# EAGLE schematic whitherbone (EAGLE 6.4)
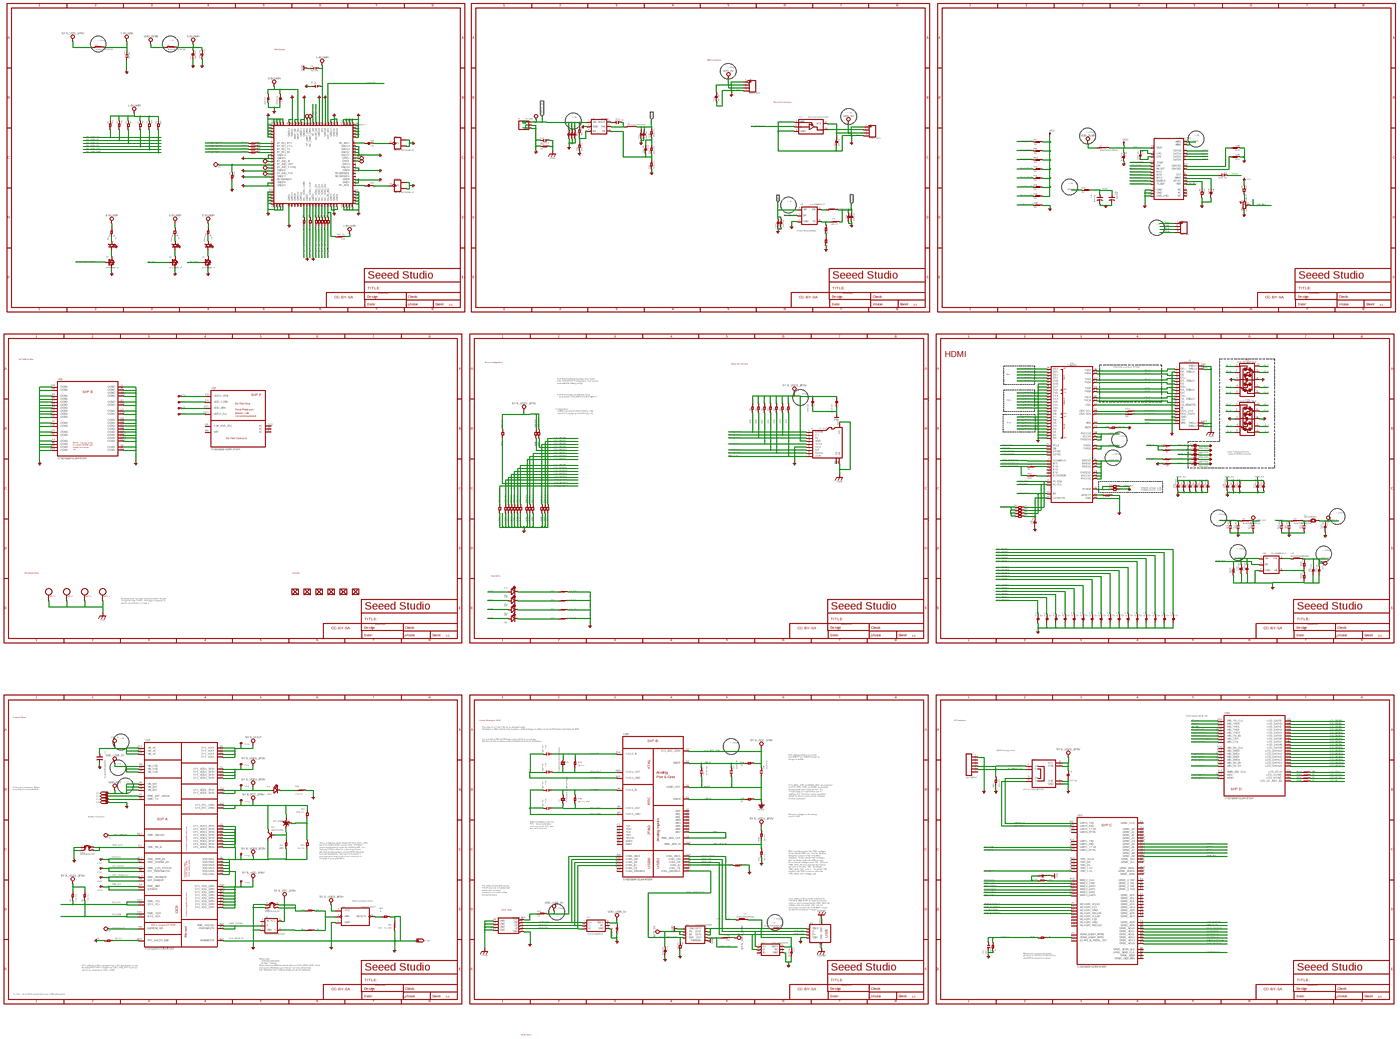
[diagram p0: schematic, sheet 1, overview]
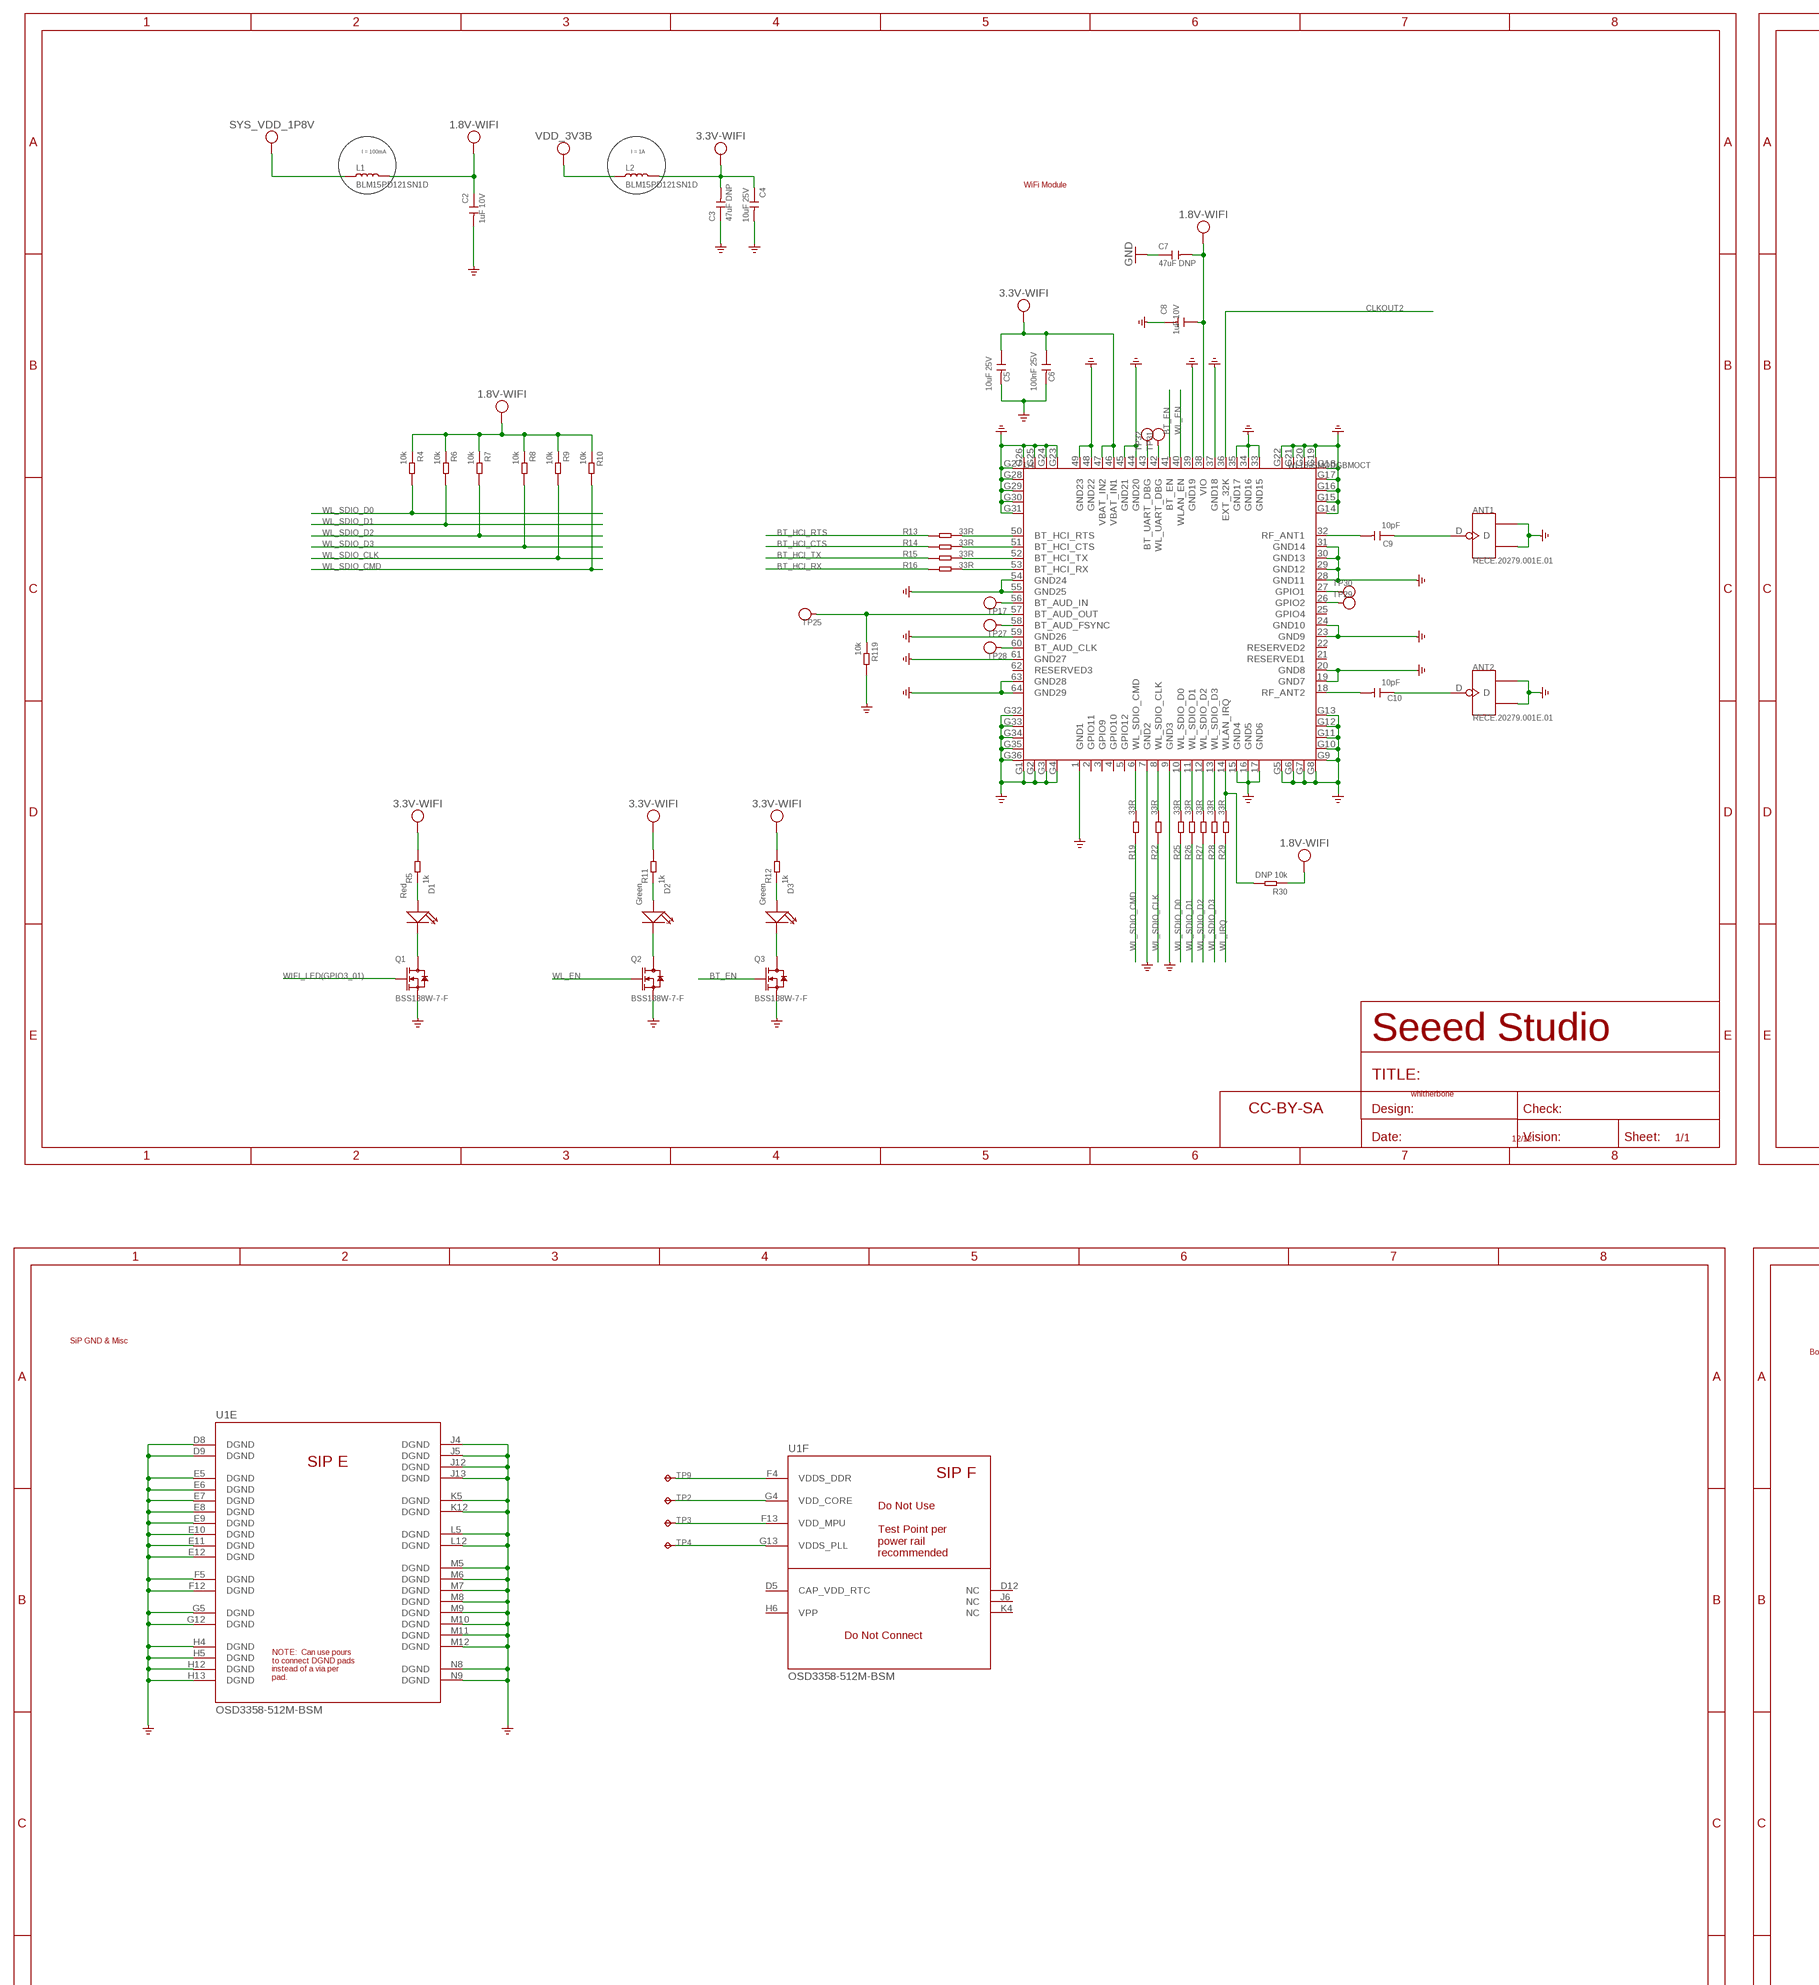
[diagram p1: schematic, sheet 1, part 1 of 8]
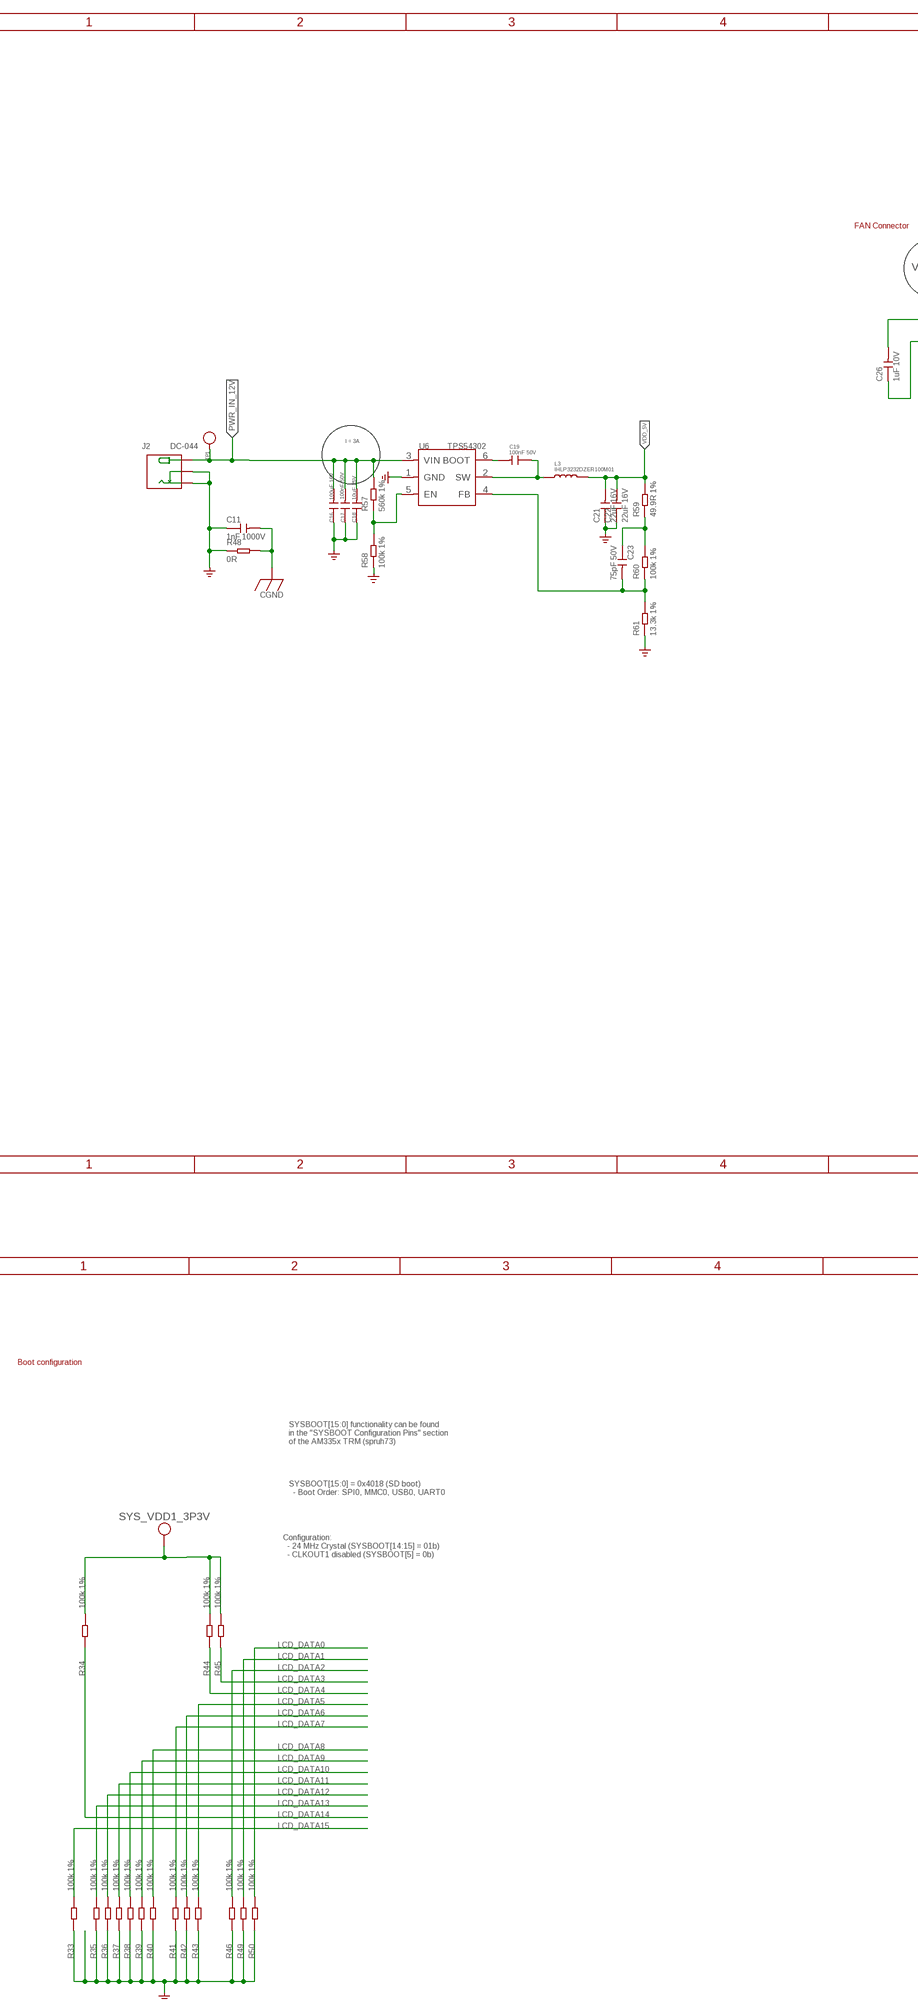
[diagram p2: schematic, sheet 1, part 2 of 8]
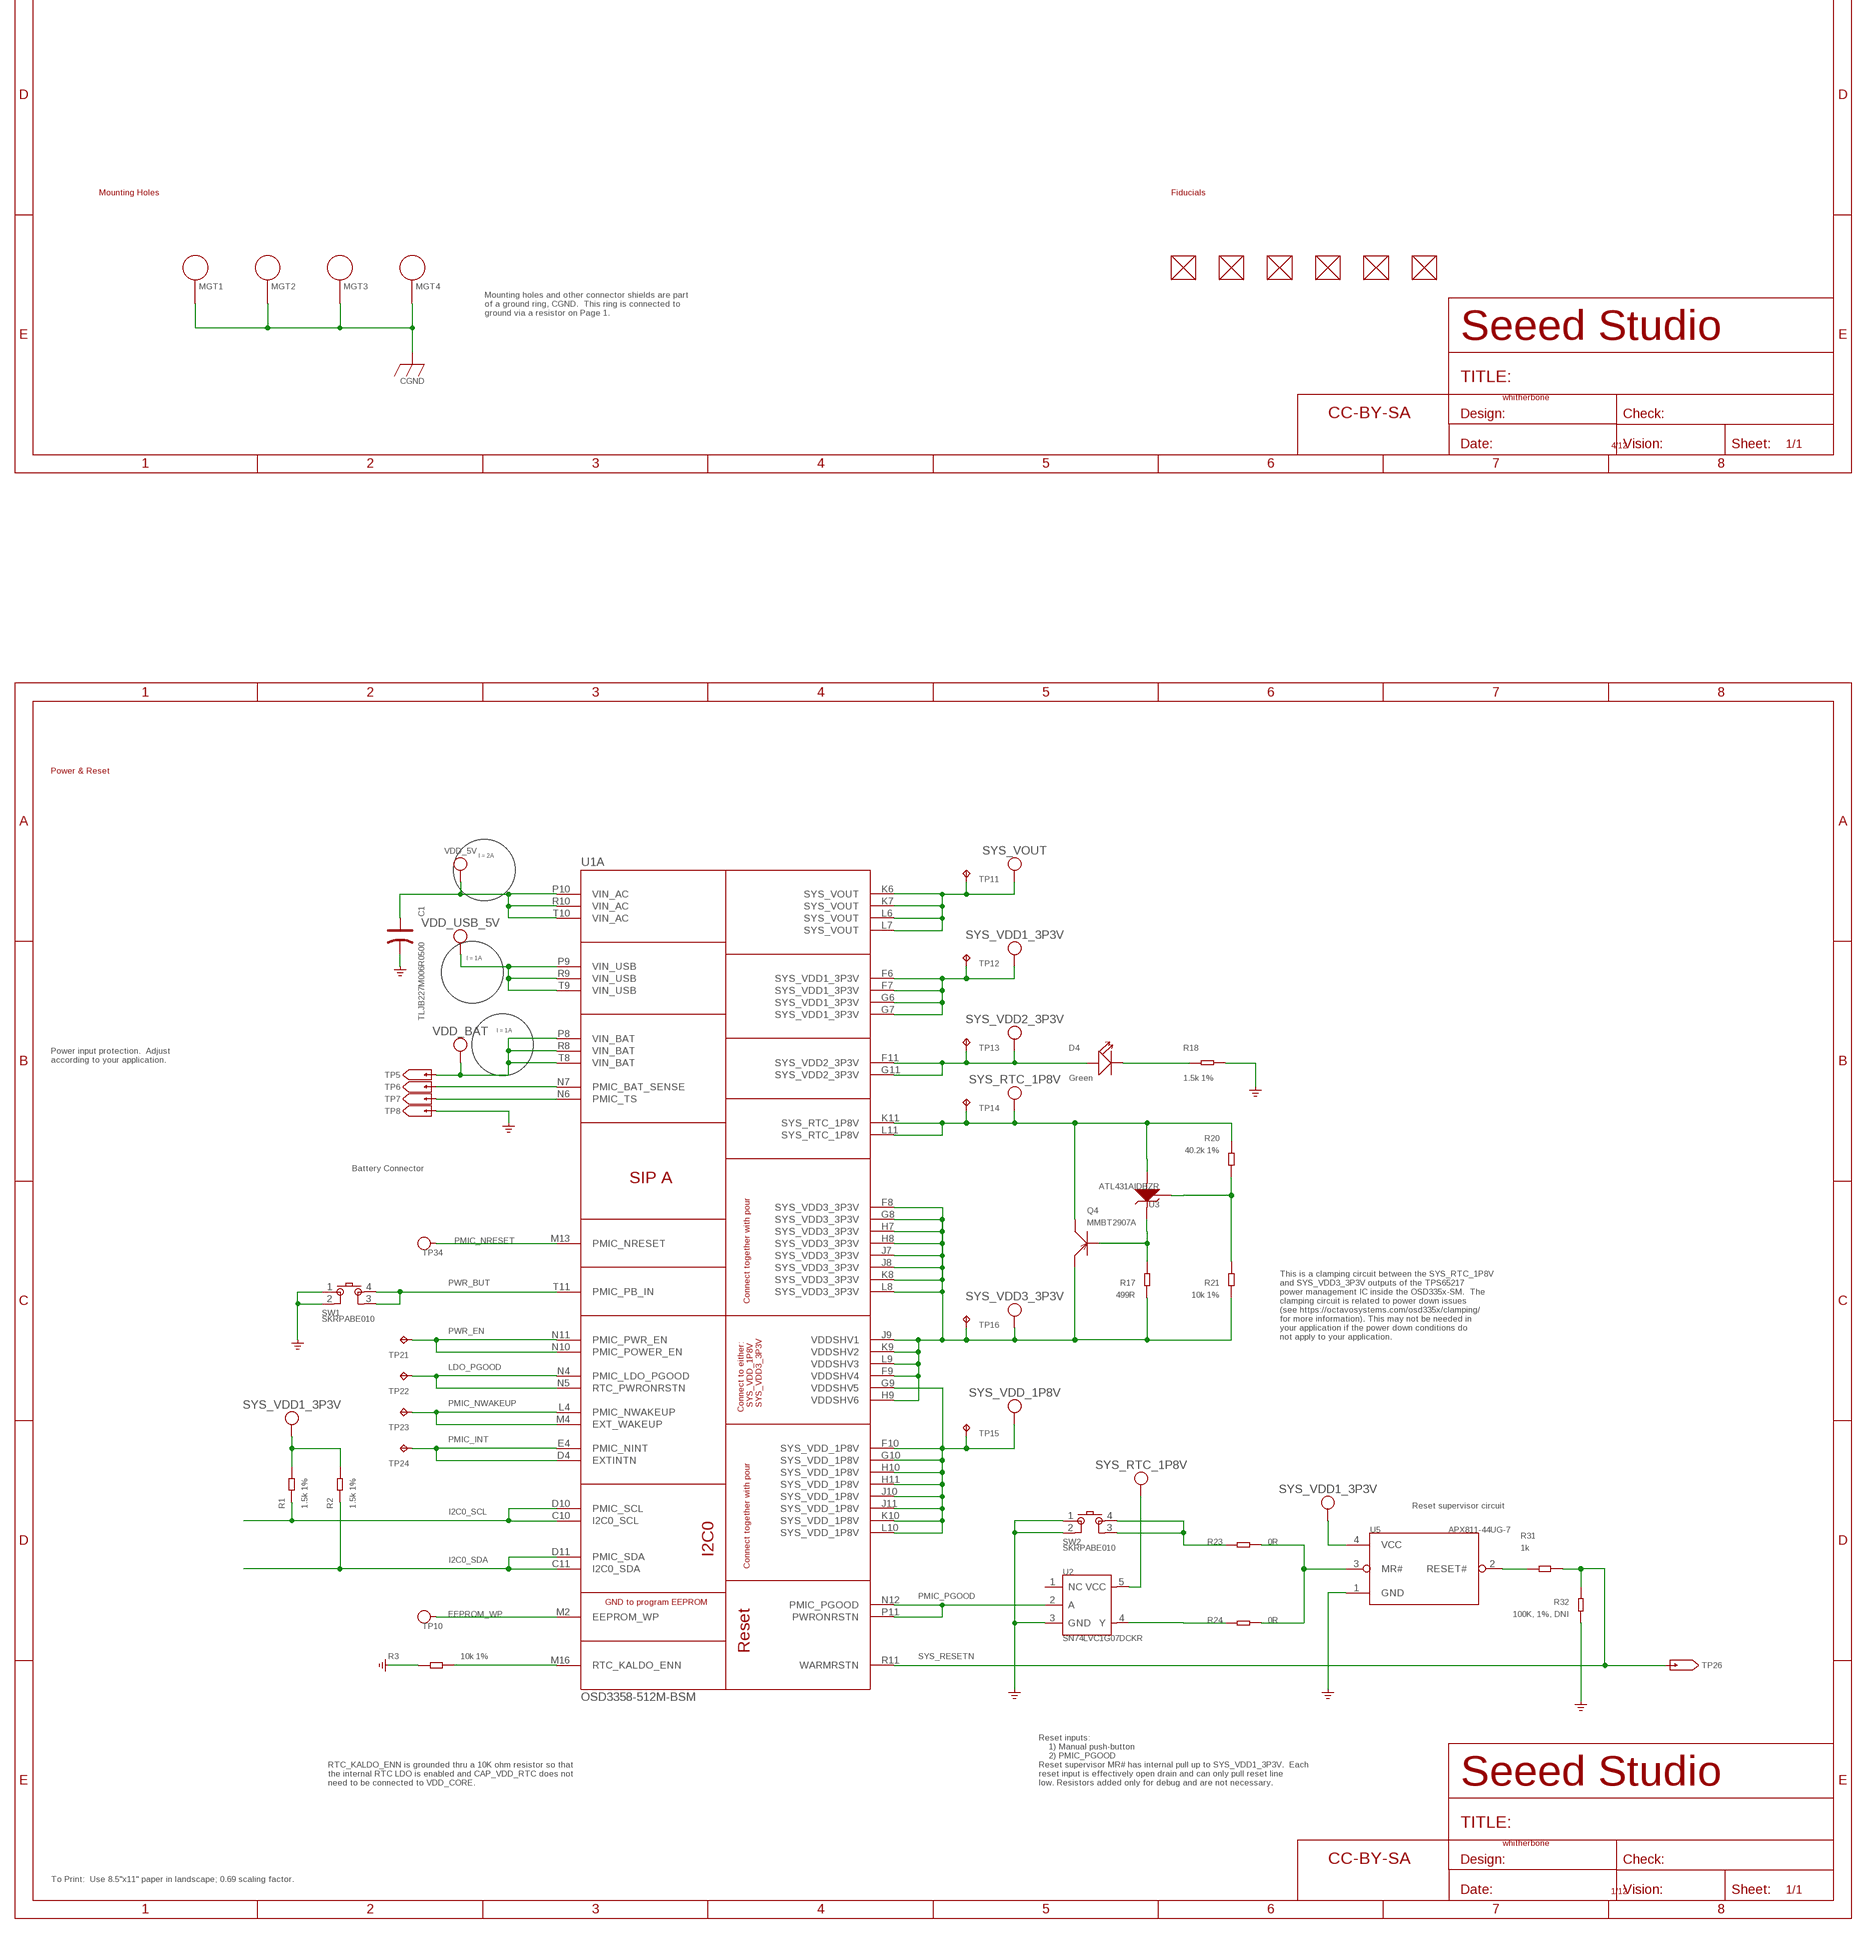
[diagram p3: schematic, sheet 1, part 3 of 8]
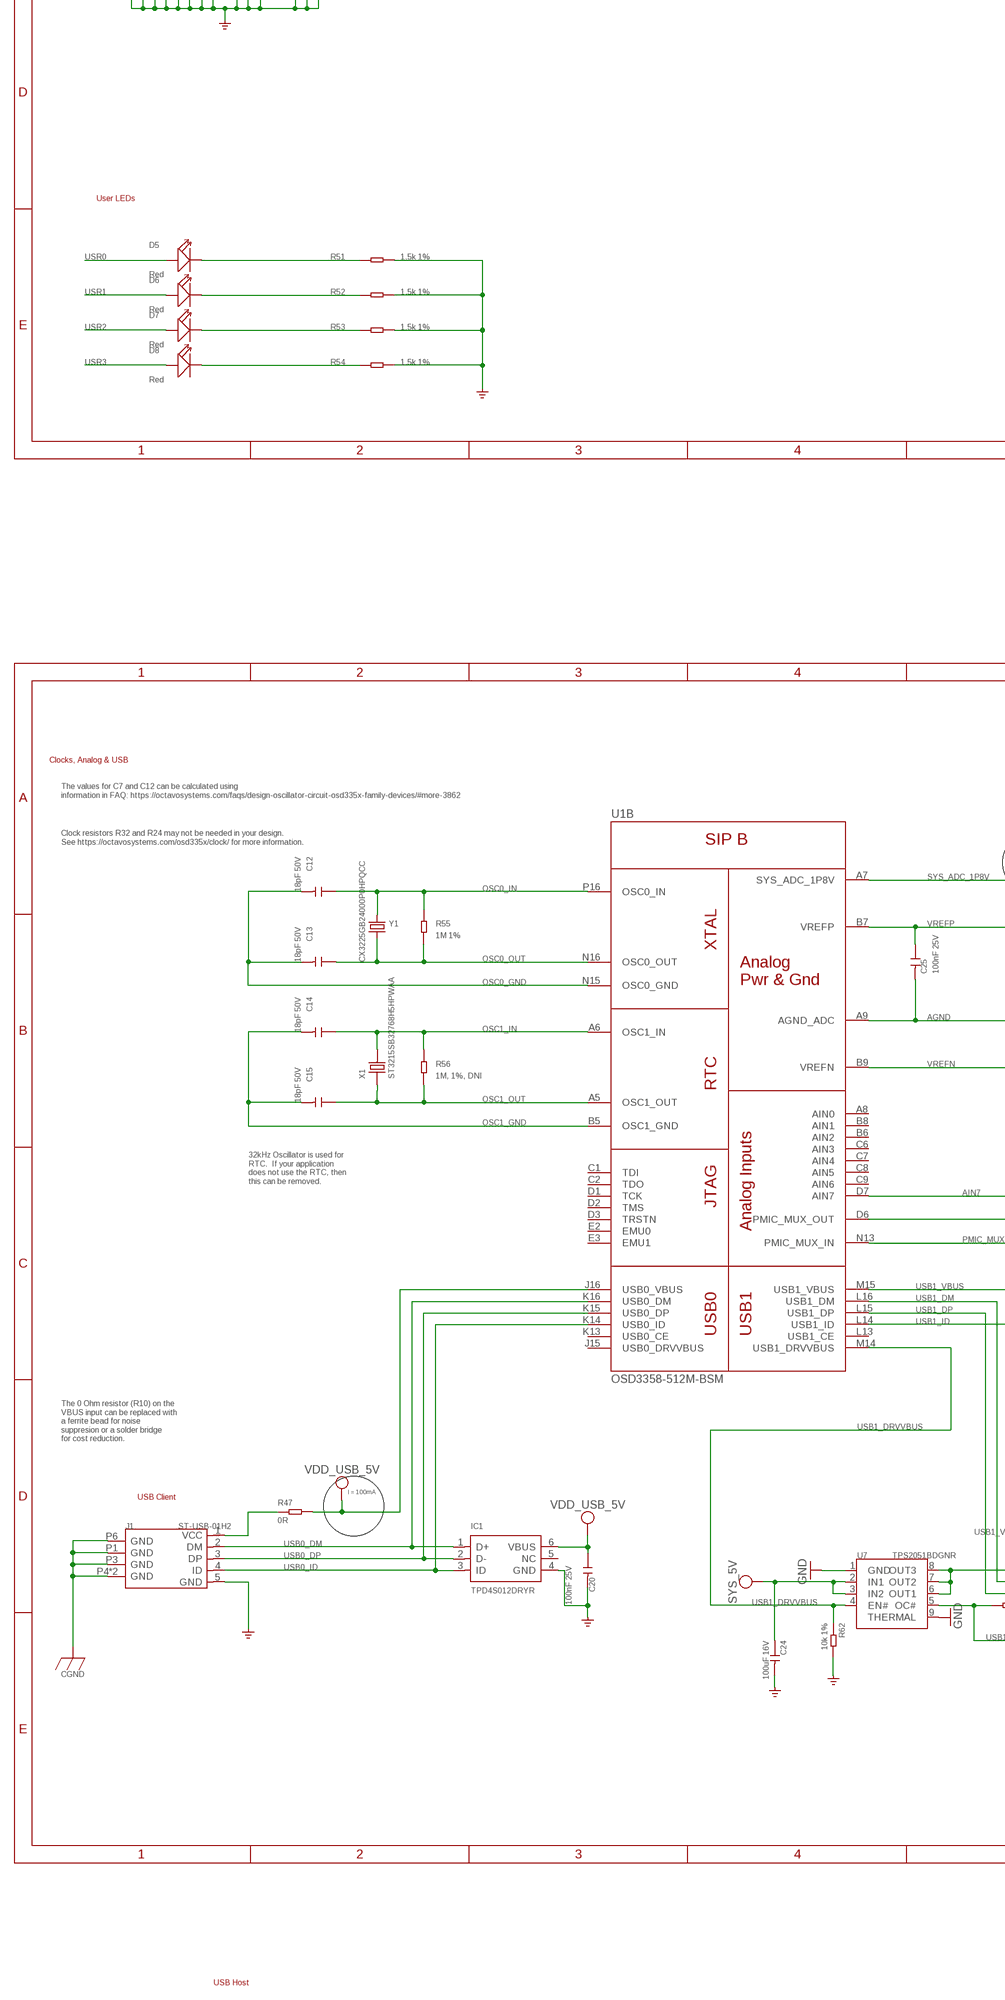
[diagram p4: schematic, sheet 1, part 4 of 8]
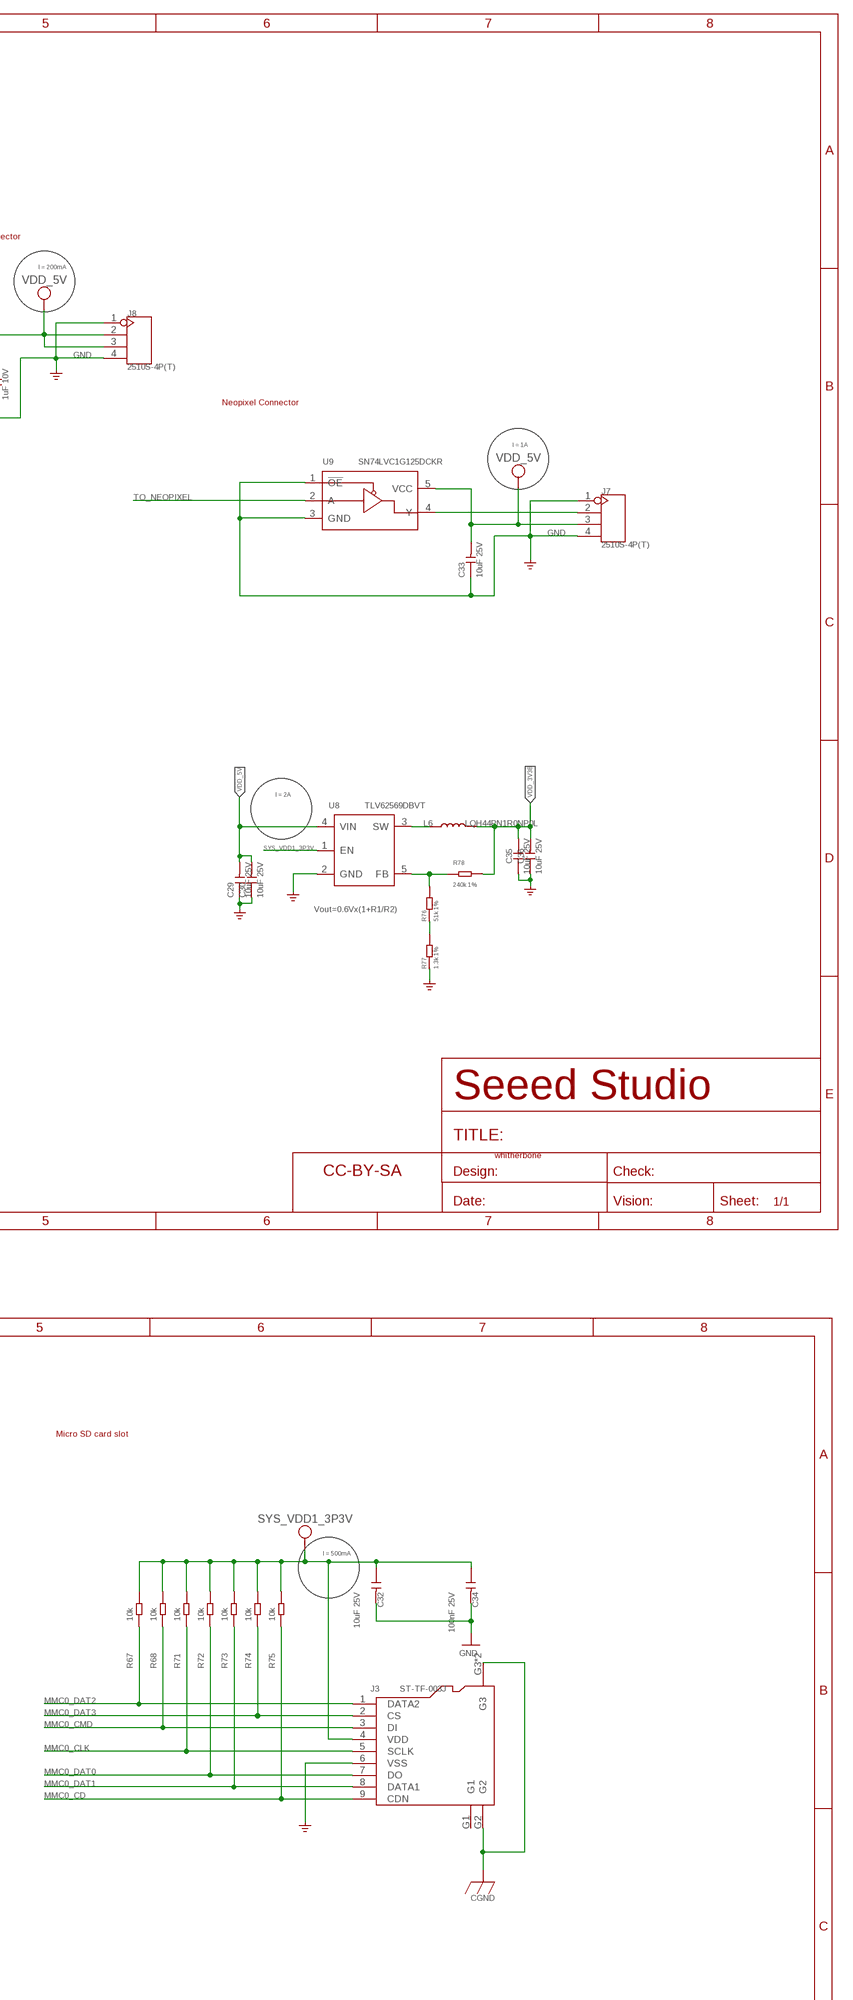
[diagram p5: schematic, sheet 1, part 5 of 8]
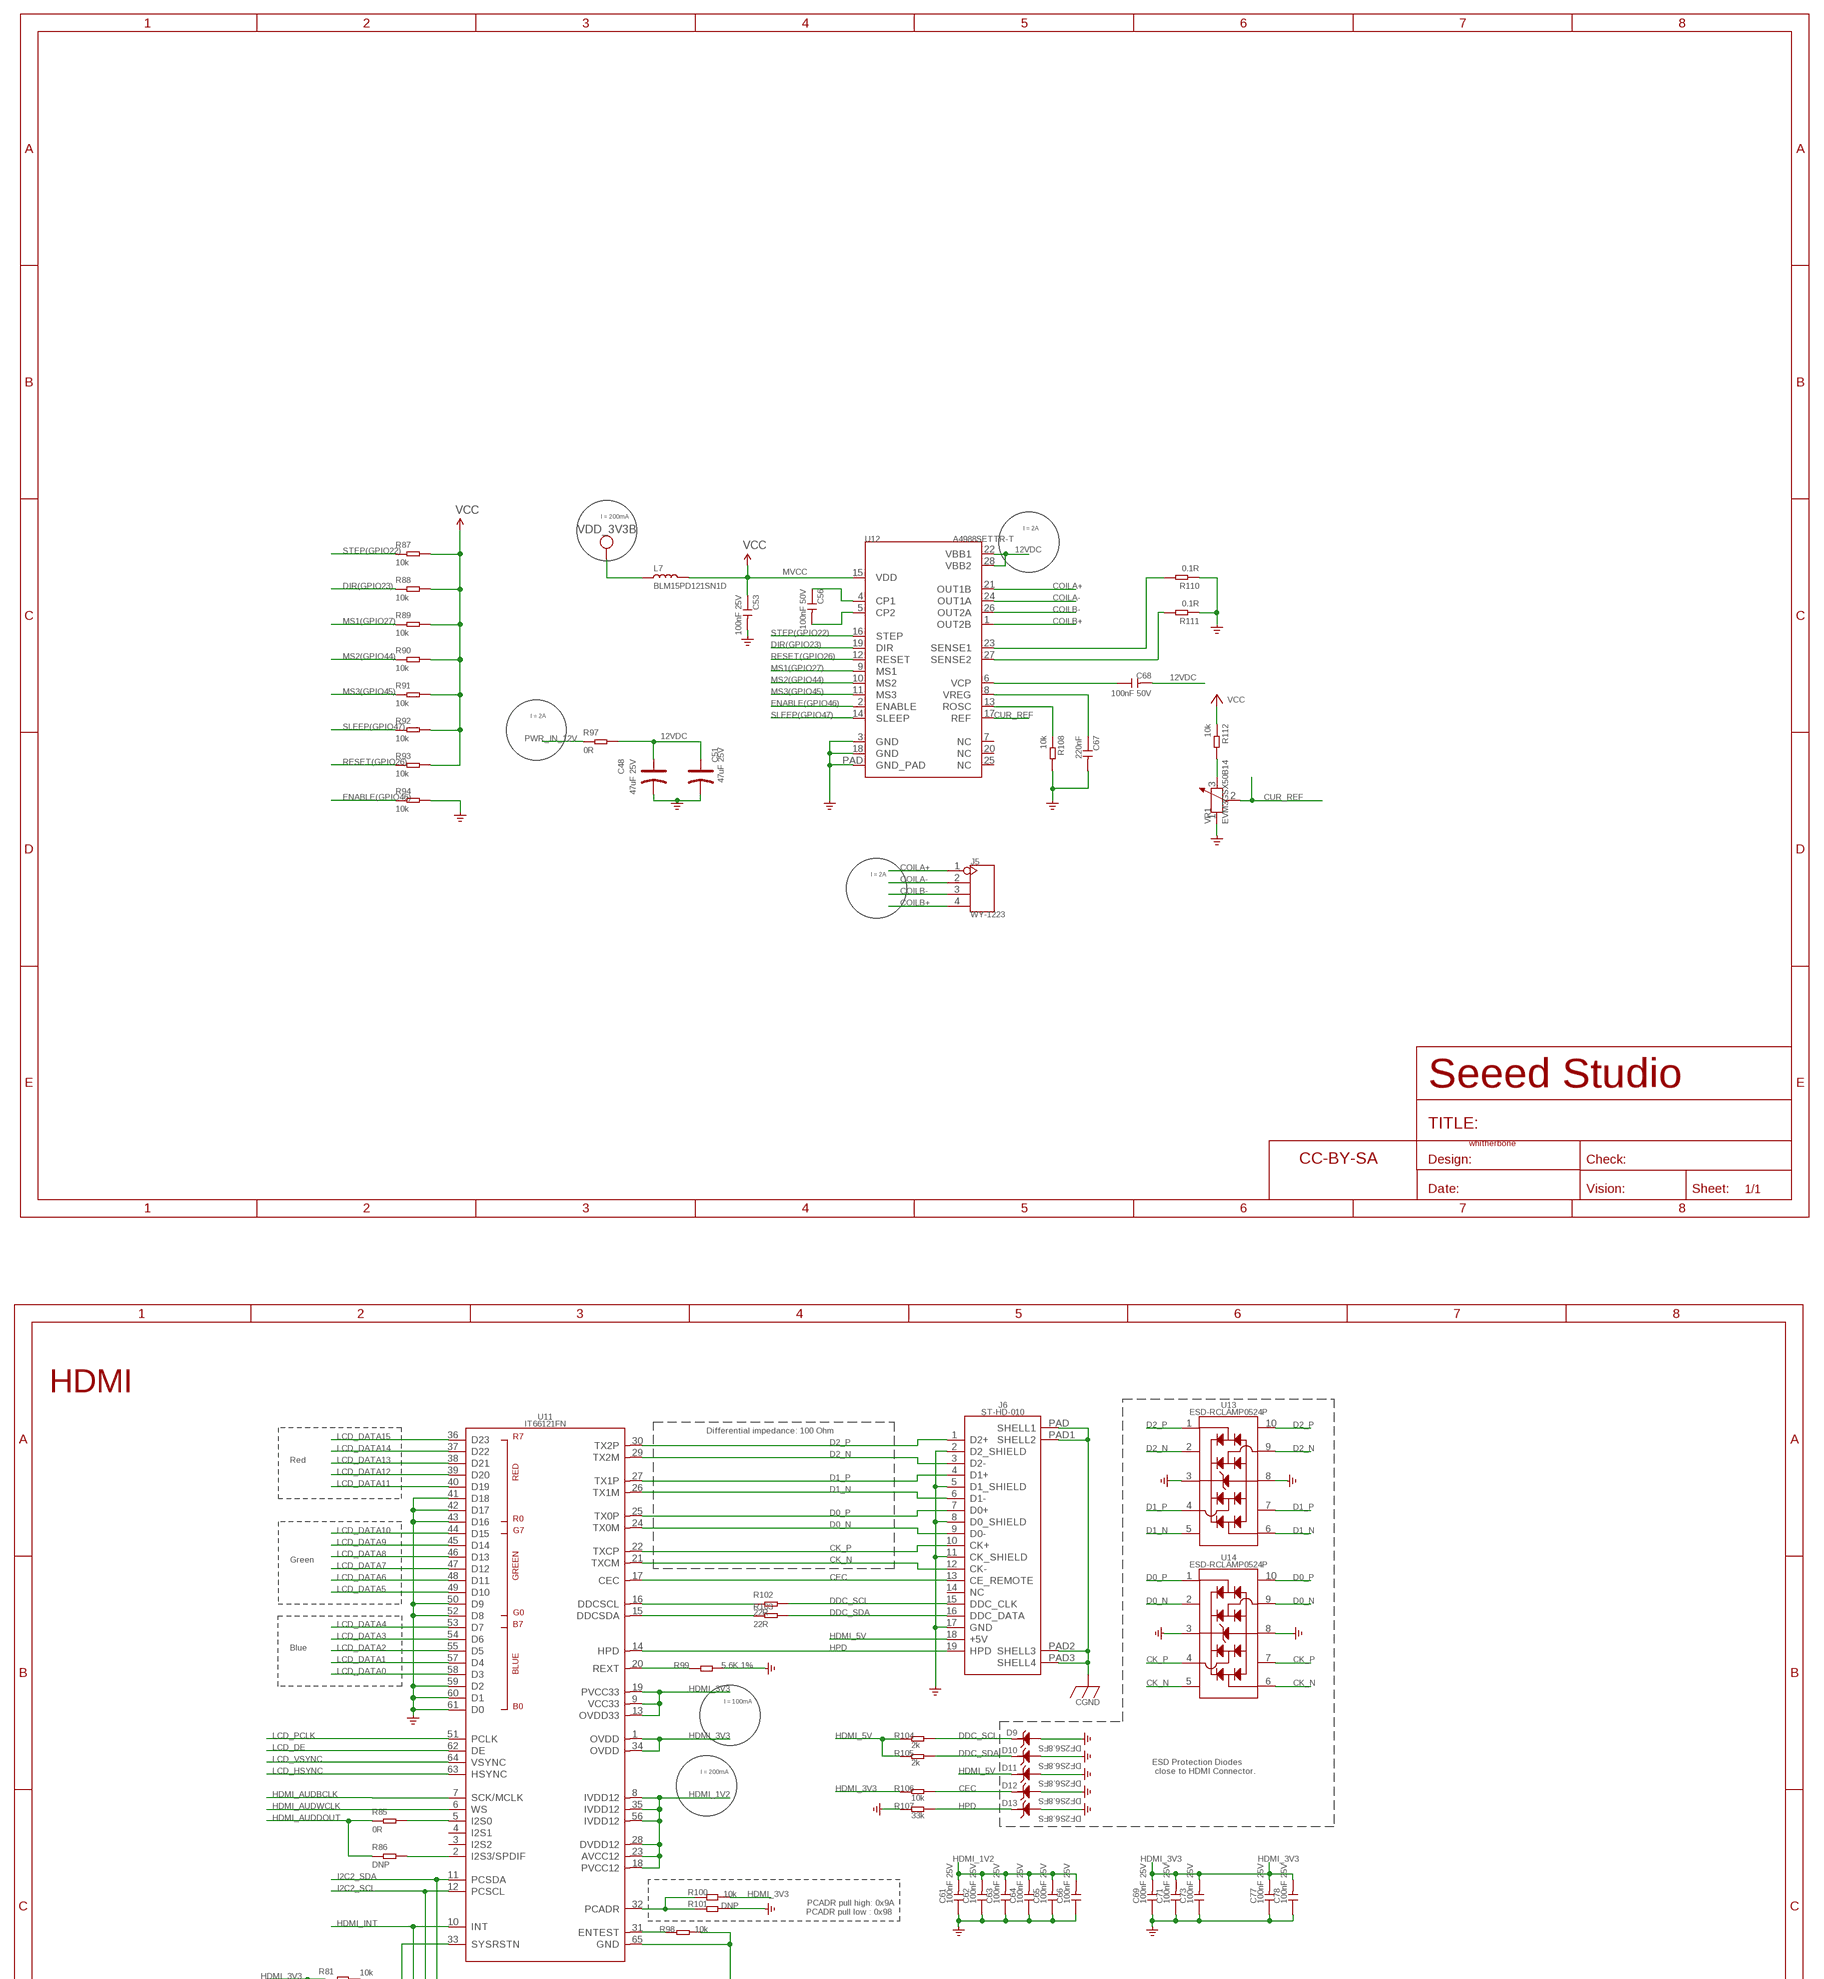
[diagram p6: schematic, sheet 1, part 6 of 8]
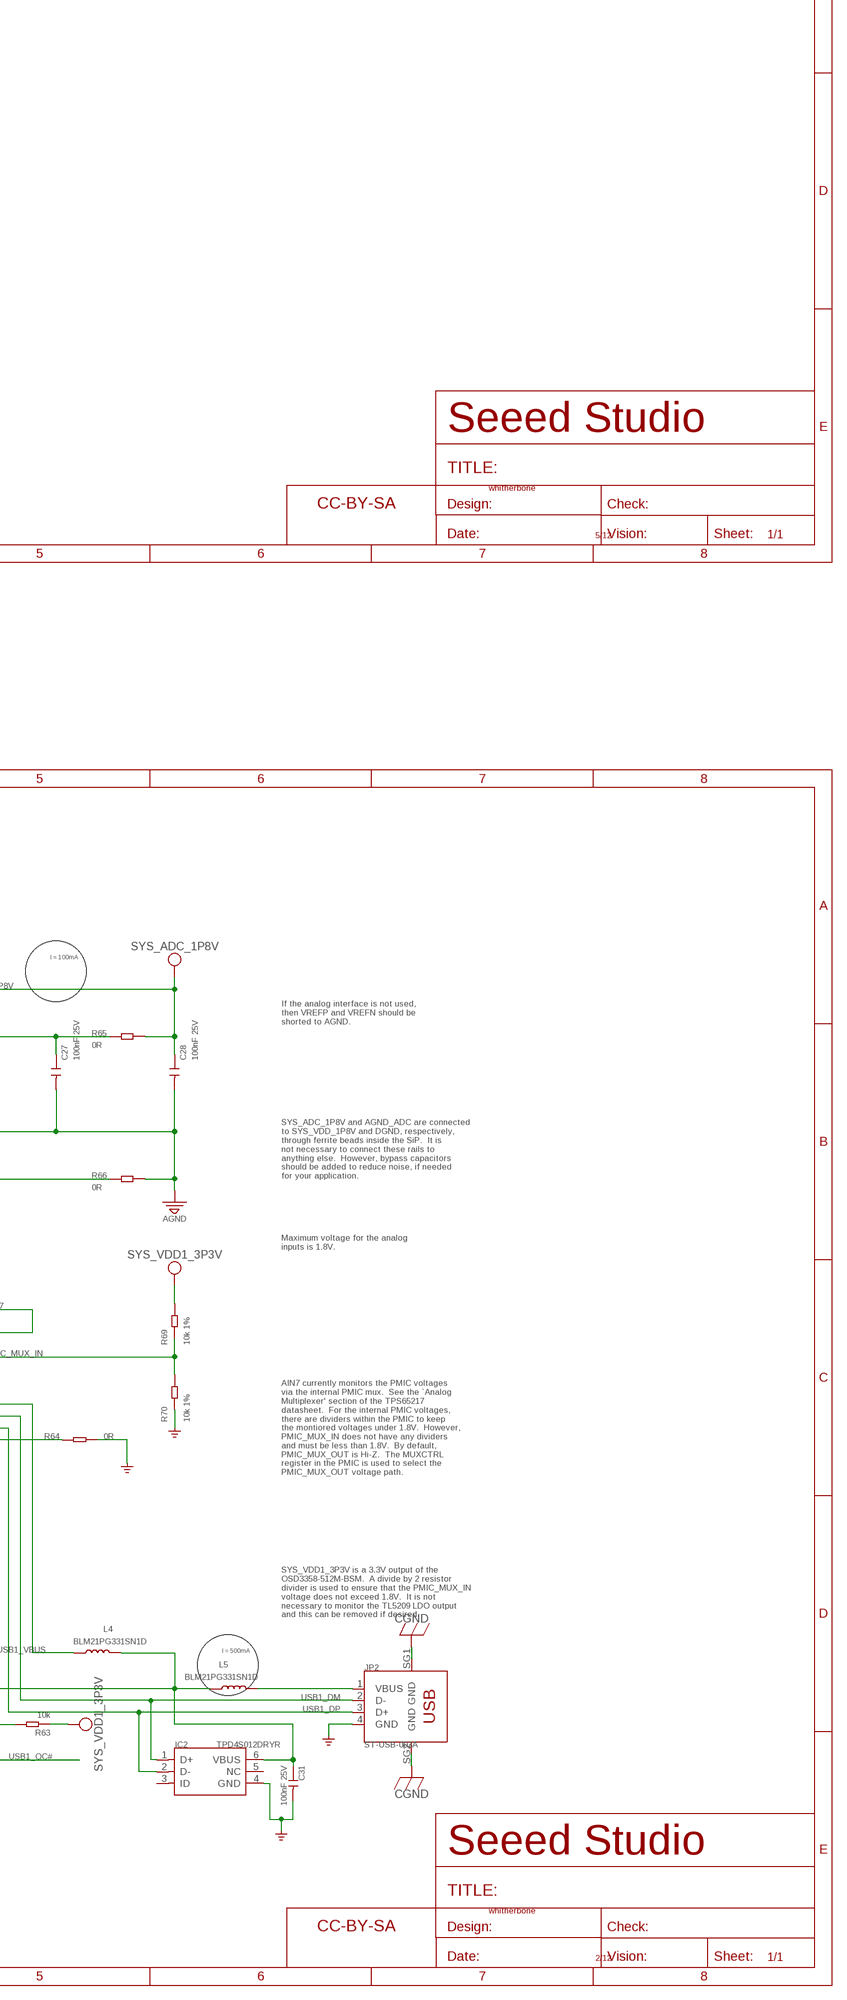
[diagram p7: schematic, sheet 1, part 7 of 8]
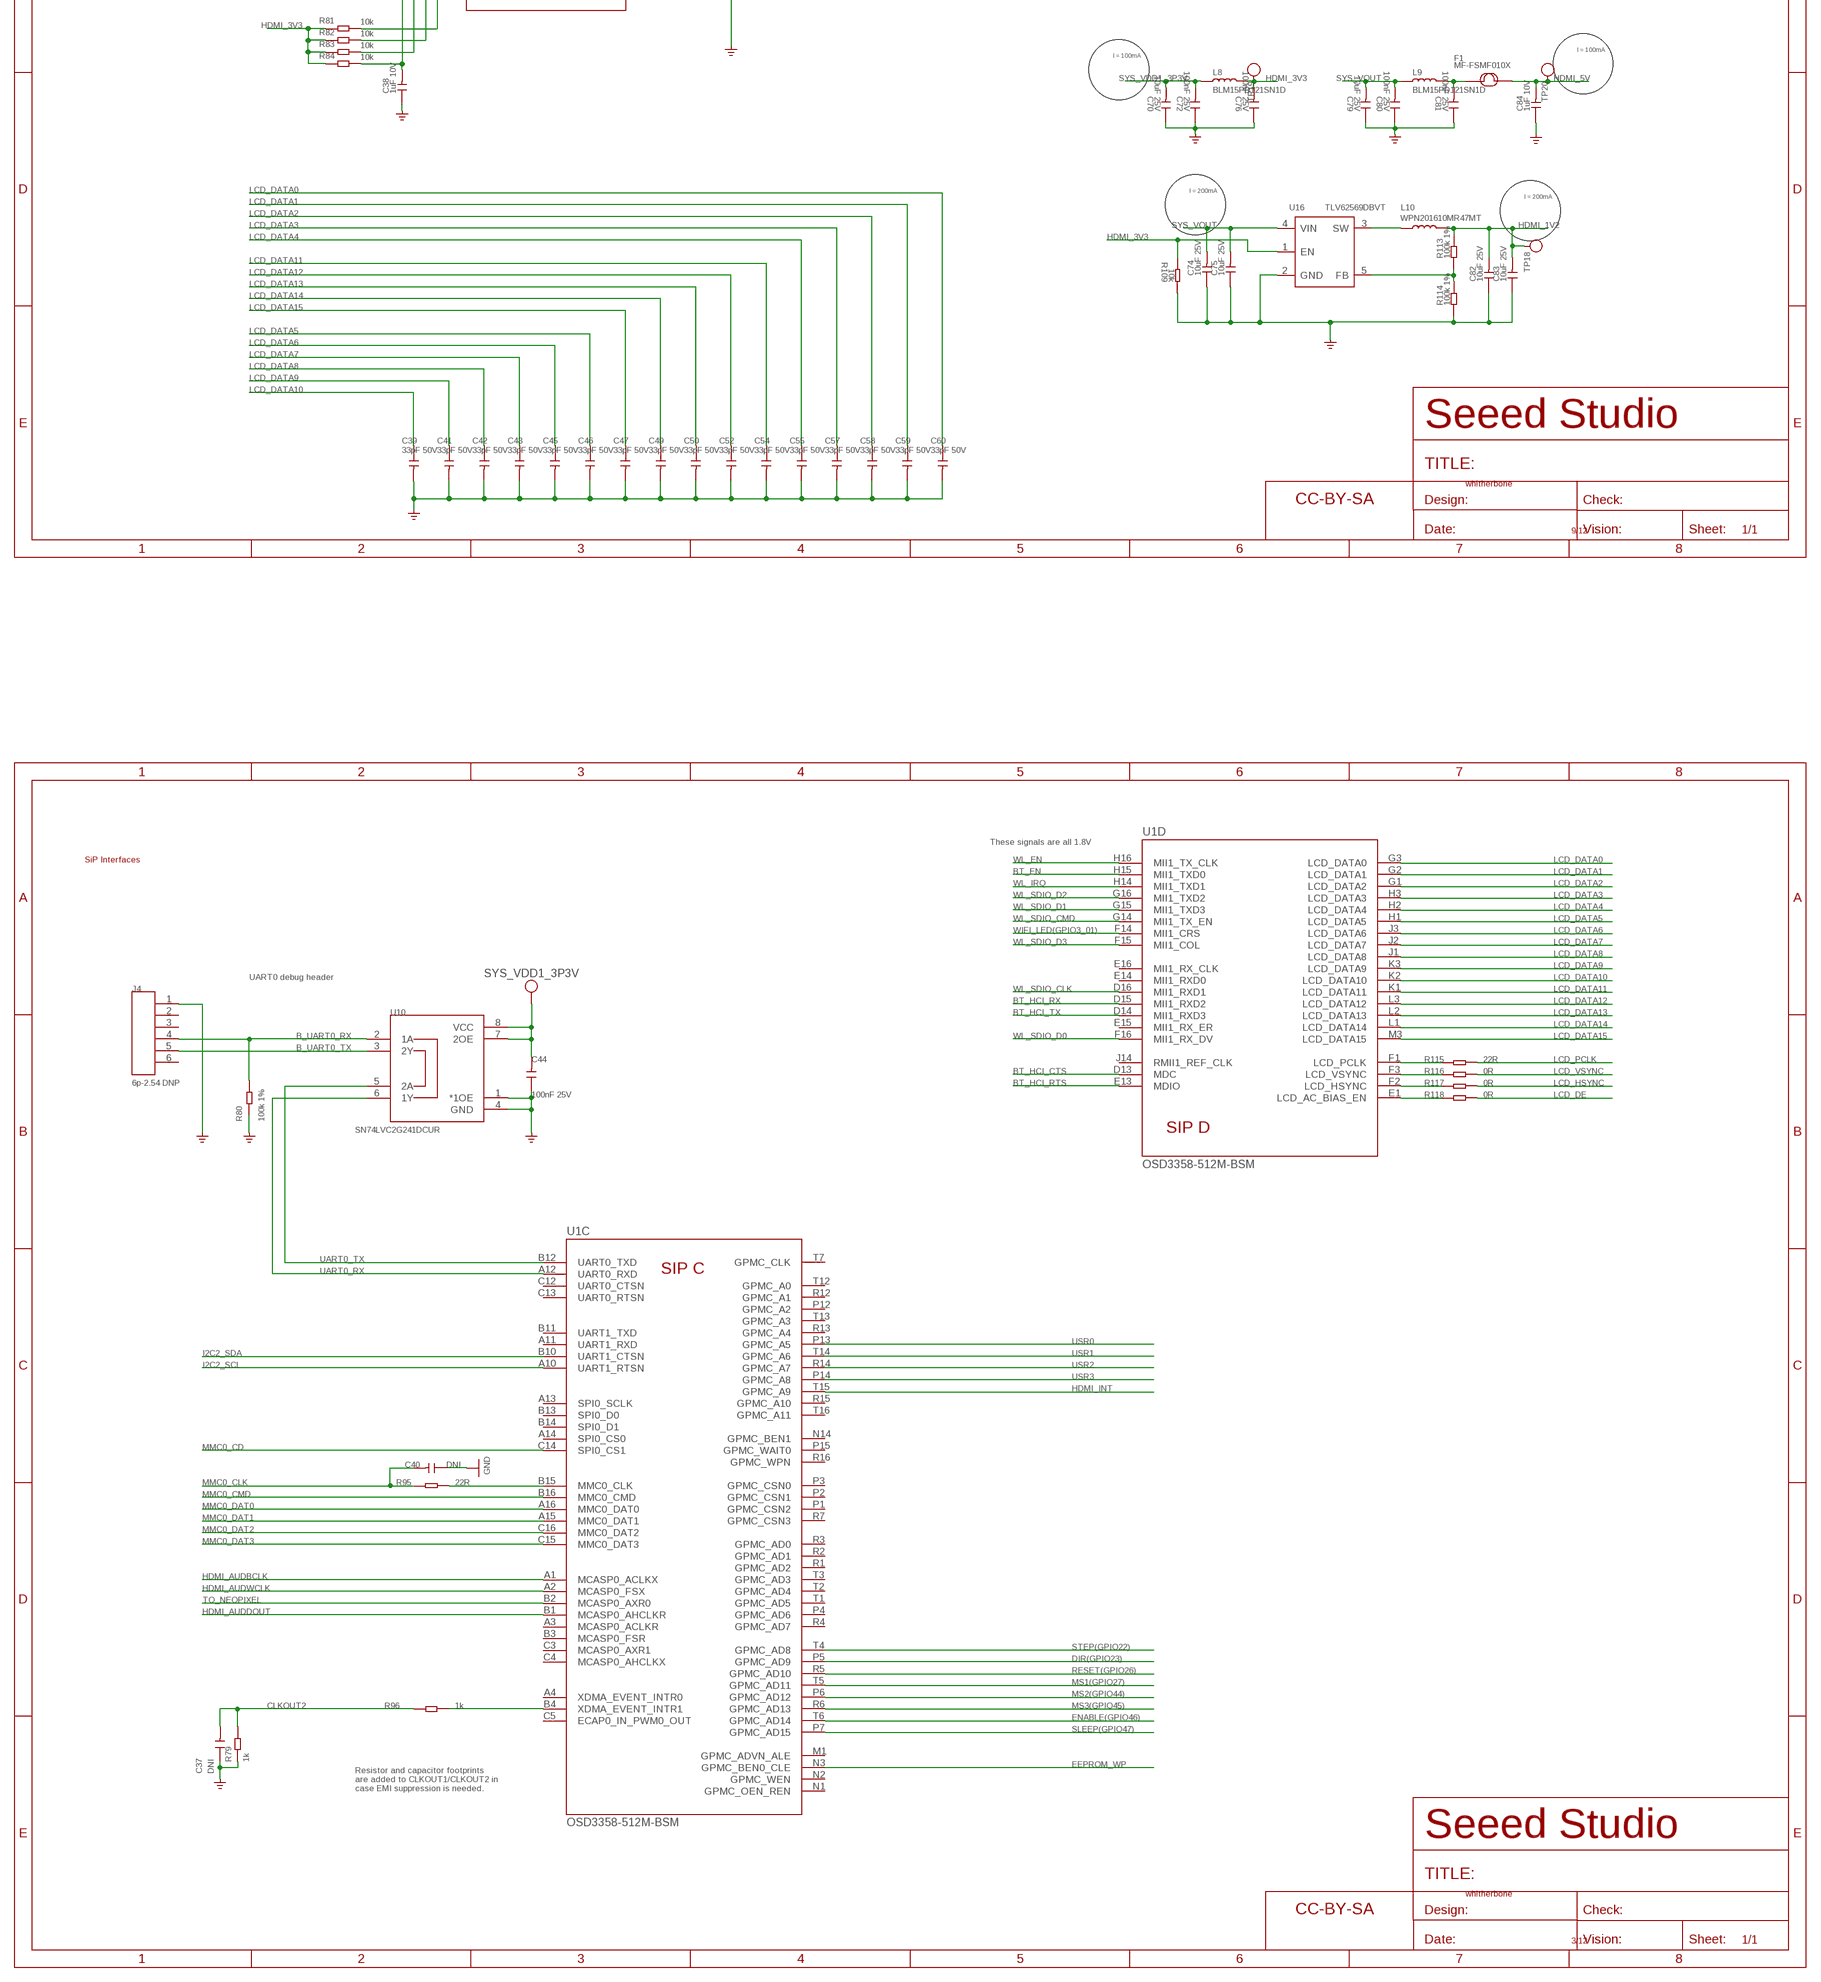
[diagram p8: schematic, sheet 1, part 8 of 8]

## Parts
ANT1  RECE.20279.001E.01  ANTENNA-U-FL-2.6X2.6  [U-FL3P-SMD-2.6X2.6X1.0MM]
ANT2  RECE.20279.001E.01  ANTENNA-U-FL-2.6X2.6  [U-FL3P-SMD-2.6X2.6X1.0MM]
C1  TLJB227M006R0500  CAP-POLAR-AVX-B  [AVX-B]
C2  1uF 10V  CAP-0402  [C0402]
C3  47uF DNP  CAP-1206  [C1206]
C4  10uF 25V  CAP-0805  [C0805]
C5  10uF 25V  CAP-0805  [C0805]
C6  100nF 25V  CAP-0402  [C0402]
C7  47uF DNP  CAP-1206  [C1206]
C8  1uF 10V  CAP-0402  [C0402]
C9  10pF  CAP-0402  [C0402]
C10  10pF  CAP-0402  [C0402]
C11  1nF 1000V  CAP-1206  [C1206]
C12  18pF 50V  CAP-0402  [C0402]
C13  18pF 50V  CAP-0402  [C0402]
C14  18pF 50V  CAP-0402  [C0402]
C15  18pF 50V  CAP-0402  [C0402]
C16  100uF 16V  CAP-1210  [C1210]
C17  100nF 50V  CAP-0805  [C0805]
C18  10uF 25V  CAP-0805  [C0805]
C19  100nF 50V  CAP-0805  [C0805]
C20  100nF 25V  CAP-0402  [C0402]
C21  22uF 16V  CAP-1206  [C1206]
C22  22uF 16V  CAP-1206  [C1206]
C23  75pF 50V  CAP-0402  [C0402]
C24  100uF 16V  CAP-1210  [C1210]
C25  100nF 25V  CAP-0402  [C0402]
C26  1uF 10V  CAP-0402  [C0402]
C27  100nF 25V  CAP-0402  [C0402]
C28  100nF 25V  CAP-0402  [C0402]
C29  10uF 25V  CAP-0805  [C0805]
C30  10uF 25V  CAP-0805  [C0805]
C31  100nF 25V  CAP-0402  [C0402]
C32  10uF 25V  CAP-0805  [C0805]
C33  10uF 25V  CAP-0805  [C0805]
C34  100nF 25V  CAP-0402  [C0402]
C35  10uF 25V  CAP-0805  [C0805]
C36  10uF 25V  CAP-0805  [C0805]
C37  DNI  CAP-0402  [C0402]
C38  1uF 10V  CAP-0402  [C0402]
C39  33pF 50V  CAP-0402  [C0402]
C40  DNI  CAP-0402  [C0402]
C41  33pF 50V  CAP-0402  [C0402]
C42  33pF 50V  CAP-0402  [C0402]
C43  33pF 50V  CAP-0402  [C0402]
C44  100nF 25V  CAP-0402  [C0402]
C45  33pF 50V  CAP-0402  [C0402]
C46  33pF 50V  CAP-0402  [C0402]
C47  33pF 50V  CAP-0402  [C0402]
C48  47uF 25V  CAP-POLAR-ELECTRO-C  [ELECTRO-SMD-C-6MM]
C49  33pF 50V  CAP-0402  [C0402]
C50  33pF 50V  CAP-0402  [C0402]
C51  47uF 25V  CAP-POLAR-ELECTRO-C  [ELECTRO-SMD-C-6MM]
C52  33pF 50V  CAP-0402  [C0402]
C53  100nF 25V  CAP-0402  [C0402]
C54  33pF 50V  CAP-0402  [C0402]
C55  33pF 50V  CAP-0402  [C0402]
C56  100nF 50V  CAP-0805  [C0805]
C57  33pF 50V  CAP-0402  [C0402]
C58  33pF 50V  CAP-0402  [C0402]
C59  33pF 50V  CAP-0402  [C0402]
C60  33pF 50V  CAP-0402  [C0402]
C61  100nF 25V  CAP-0402  [C0402]
C62  100nF 25V  CAP-0402  [C0402]
C63  100nF 25V  CAP-0402  [C0402]
C64  100nF 25V  CAP-0402  [C0402]
C65  100nF 25V  CAP-0402  [C0402]
C66  100nF 25V  CAP-0402  [C0402]
C67  220nF  CAP-0402  [C0402]
C68  100nF 50V  CAP-0805  [C0805]
C69  100nF 25V  CAP-0402  [C0402]
C70  10uF 25V  CAP-0805  [C0805]
C71  100nF 25V  CAP-0402  [C0402]
C72  100nF 25V  CAP-0402  [C0402]
C73  100nF 25V  CAP-0402  [C0402]
C74  10uF 25V  CAP-0805  [C0805]
C75  10uF 25V  CAP-0805  [C0805]
C76  100nF 25V  CAP-0402  [C0402]
C77  100nF 25V  CAP-0402  [C0402]
C78  100nF 25V  CAP-0402  [C0402]
C79  10uF 25V  CAP-0805  [C0805]
C80  100nF 25V  CAP-0402  [C0402]
C81  100nF 25V  CAP-0402  [C0402]
C82  10uF 25V  CAP-0805  [C0805]
C83  10uF 25V  CAP-0805  [C0805]
C84  1uF 10V  CAP-0402  [C0402]
D1  Red  LED'0603'  [LED-0603]
D2  Green  LED'0603'  [LED-0603]
D3  Green  LED'0603'  [LED-0603]
D4  Green  LED'0603'  [LED-0603]
D5  Red  LED'0603'  [LED-0603]
D6  Red  LED'0603'  [LED-0603]
D7  Red  LED'0603'  [LED-0603]
D8  Red  LED'0603'  [LED-0603]
D9  DF2S6.8FS  D-ESD-2P'DF2S6.8FS'  [SOD-923]
D10  DF2S6.8FS  D-ESD-2P'DF2S6.8FS'  [SOD-923]
D11  DF2S6.8FS  D-ESD-2P'DF2S6.8FS'  [SOD-923]
D12  DF2S6.8FS  D-ESD-2P'DF2S6.8FS'  [SOD-923]
D13  DF2S6.8FS  D-ESD-2P'DF2S6.8FS'  [SOD-923]
F1  MF-FSMF010X  FUSE0603  [F0603]
FUD1  FIDUCIAL  [FIDUCIAL_40MIL]
FUD2  FIDUCIAL  [FIDUCIAL_40MIL]
FUD3  FIDUCIAL  [FIDUCIAL_40MIL]
FUD4  FIDUCIAL  [FIDUCIAL_40MIL]
FUD5  FIDUCIAL  [FIDUCIAL_40MIL]
FUD6  FIDUCIAL  [FIDUCIAL_40MIL]
IC1  TPD4S012DRYR  TVS-TPD4S012DRYR  [SON6-0.5-1.45X1X0.55MM]
IC2  TPD4S012DRYR  TVS-TPD4S012DRYR  [SON6-0.5-1.45X1X0.55MM]
J1  ST-USB-01H2  MICRO-USB5+4P-320010050  [MICRO-USB5+5P-SMD-0.65-7.2X5.06MM]
J2  DC-044  POWER-JACK-DC'DC-044'  [DCJ3P-11.6X9.6X7.0MM]
J3  ST-TF-003J  MICRO-SD-CARD-HOLDER-9P'MICROSD-9P'  [MICRO-SD9+4P-SMD-16.1X14.5X1.85MM]
J4  6p-2.54 DNP  826646-6  [H6-2.54]
J5  WY-1223  HEADER-4P-2.54MM  [H4-2.54-10.2X5.6MM]
J6  ST-HD-010  CONNECTOR-HDMI-19P  [HDMI19P-0.5-15X12.15X6.18MM]
J7  2510S-4P(T)  HEADER-4P-65/35MIL  [H4-2.54]
J8  2510S-4P(T)  HEADER-4P-65/35MIL  [H4-2.54]
JP2  ST-USB-003A  USB4+2P-320010007  [USB4+2-2.0-90D]
L1  BLM15PD121SN1D  INDUCTOR/FERRITE-BEAD'0402'  [L0402]
L2  BLM15PD121SN1D  INDUCTOR/FERRITE-BEAD'0402'  [L0402]
L3  IHLP3232DZER100M01  INDUCTOR/FERRITE-BEAD-IHLP3232DZER100M01  [INT2-7.268-8.64X8.18X4MM]
L4  BLM21PG331SN1D  INDUCTOR/FERRITE-BEAD'0805'  [L0805]
L5  BLM21PG331SN1D  INDUCTOR/FERRITE-BEAD'0805'  [L0805]
L6  LQH44PN1R0NP0L  L  [L4.4X3.0MM]
L7  BLM15PD121SN1D  INDUCTOR/FERRITE-BEAD'0402'  [L0402]
L8  BLM15PD121SN1D  INDUCTOR/FERRITE-BEAD'0402'  [L0402]
L9  BLM15PD121SN1D  INDUCTOR/FERRITE-BEAD'0402'  [L0402]
L10  WPN201610MR47MT  L-MPM201610SR33_T  [L201610]
MGT1  MOUNTING_HOLE  [MOUNTING_HOLE]
MGT2  MOUNTING_HOLE  [MOUNTING_HOLE]
MGT3  MOUNTING_HOLE  [MOUNTING_HOLE]
MGT4  MOUNTING_HOLE  [MOUNTING_HOLE]
Q1  BSS138W-7-F  MOSFET-N'SI1304BDL'  [SOT-323]
Q2  BSS138W-7-F  MOSFET-N'SI1304BDL'  [SOT-323]
Q3  BSS138W-7-F  MOSFET-N'SI1304BDL'  [SOT-323]
Q4  MMBT2907A  TRANSISTOR-PNP  [SOT-323]
R1  1.5k 1%  RES-0402  [R0402]
R2  1.5k 1%  RES-0402  [R0402]
R3  10k 1%  RES-0402  [R0402]
R4  10k  RES-0402  [R0402]
R5  1k  RES-0402  [R0402]
R6  10k  RES-0402  [R0402]
R7  10k  RES-0402  [R0402]
R8  10k  RES-0402  [R0402]
R9  10k  RES-0402  [R0402]
R10  10k  RES-0402  [R0402]
R11  1k  RES-0402  [R0402]
R12  1k  RES-0402  [R0402]
R13  33R  RES-0402  [R0402]
R14  33R  RES-0402  [R0402]
R15  33R  RES-0402  [R0402]
R16  33R  RES-0402  [R0402]
R17  499R  RES-0402  [R0402]
R18  1.5k 1%  RES-0402  [R0402]
R19  33R  RES-0402  [R0402]
R20  40.2k 1%  RES-0402  [R0402]
R21  10k 1%  RES-0402  [R0402]
R22  33R  RES-0402  [R0402]
R23  0R  RES-0402  [R0402]
R24  0R  RES-0402  [R0402]
R25  33R  RES-0402  [R0402]
R26  33R  RES-0402  [R0402]
R27  33R  RES-0402  [R0402]
R28  33R  RES-0402  [R0402]
R29  33R  RES-0402  [R0402]
R30  DNP 10k  RES-0402  [R0402]
R31  1k  RES-0402  [R0402]
R32  100K, 1%, DNI  RES-0402  [R0402]
R33  100k 1%  RES-0402  [R0402]
R34  100k 1%  RES-0402  [R0402]
R35  100k 1%  RES-0402  [R0402]
R36  100k 1%  RES-0402  [R0402]
R37  100k 1%  RES-0402  [R0402]
R38  100k 1%  RES-0402  [R0402]
R39  100k 1%  RES-0402  [R0402]
R40  100k 1%  RES-0402  [R0402]
R41  100k 1%  RES-0402  [R0402]
R42  100k 1%  RES-0402  [R0402]
R43  100k 1%  RES-0402  [R0402]
R44  100k 1%  RES-0402  [R0402]
R45  100k 1%  RES-0402  [R0402]
R46  100k 1%  RES-0402  [R0402]
R47  0R  RES-0402  [R0402]
R48  0R  RES-1206  [R1206]
R49  100k 1%  RES-0402  [R0402]
R50  100k 1%  RES-0402  [R0402]
R51  1.5k 1%  RES-0402  [R0402]
R52  1.5k 1%  RES-0402  [R0402]
R53  1.5k 1%  RES-0402  [R0402]
R54  1.5k 1%  RES-0402  [R0402]
R55  1M 1%  RES-0402  [R0402]
R56  1M, 1%, DNI  RES-0402  [R0402]
R57  560k 1%  RES-0402  [R0402]
R58  100k 1%  RES-0402  [R0402]
R59  49.9R 1%  RES-0402  [R0402]
R60  100k 1%  RES-0402  [R0402]
R61  13.3k 1%  RES-0402  [R0402]
R62  10k 1%  RES-0402  [R0402]
R63  10k  RES-0402  [R0402]
R64  0R  RES-0402  [R0402]
R65  0R  RES-0402  [R0402]
R66  0R  RES-0402  [R0402]
R67  10k  RES-0402  [R0402]
R68  10k  RES-0402  [R0402]
R69  10k 1%  RES-0402  [R0402]
R70  10k 1%  RES-0402  [R0402]
R71  10k  RES-0402  [R0402]
R72  10k  RES-0402  [R0402]
R73  10k  RES-0402  [R0402]
R74  10k  RES-0402  [R0402]
R75  10k  RES-0402  [R0402]
R76  51k 1%  RES-0402  [R0402]
R77  1.3k 1%  RES-0402  [R0402]
R78  240k 1%  RES-0402  [R0402]
R79  1k  RES-0402  [R0402]
R80  100k 1%  RES-0402  [R0402]
R81  10k  RES-0402  [R0402]
R82  10k  RES-0402  [R0402]
R83  10k  RES-0402  [R0402]
R84  10k  RES-0402  [R0402]
R85  0R  RES-0402  [R0402]
R86  DNP  RES-0402  [R0402]
R87  10k  RES-0402  [R0402]
R88  10k  RES-0402  [R0402]
R89  10k  RES-0402  [R0402]
R90  10k  RES-0402  [R0402]
R91  10k  RES-0402  [R0402]
R92  10k  RES-0402  [R0402]
R93  10k  RES-0402  [R0402]
R94  10k  RES-0402  [R0402]
R95  22R  RES-0402  [R0402]
R96  1k  RES-0402  [R0402]
R97  0R  RES-1206  [R1206]
R98  10k  RES-0402  [R0402]
R99  5.6K 1%  RES-0402  [R0402]
R100  10k  RES-0402  [R0402]
R101  DNP  RES-0402  [R0402]
R102  22R  RES-0402  [R0402]
R103  22R  RES-0402  [R0402]
R104  2k  RES-0402  [R0402]
R105  2k  RES-0402  [R0402]
R106  10k  RES-0402  [R0402]
R107  33k  RES-0402  [R0402]
R108  10k  RES-0402  [R0402]
R109  10k  RES-0402  [R0402]
R110  0.1R  RES-1206  [R1206]
R111  0.1R  RES-1206  [R1206]
R112  10k  RES-0402  [R0402]
R113  100k 1%  RES-0402  [R0402]
R114  100k 1%  RES-0402  [R0402]
R115  22R  RES-0402  [R0402]
R116  0R  RES-0402  [R0402]
R117  0R  RES-0402  [R0402]
R118  0R  RES-0402  [R0402]
R119  10k  RES-0402  [R0402]
SW1  SKRPABE010  BUTTON-4P+  [BUTTON4P-SMD-4.5X3.2X2.5MM]
SW2  SKRPABE010  BUTTON-4P+  [BUTTON4P-SMD-4.5X3.2X2.5MM]
TP1  PAD-TEST-POINT'4545'  [TP_4545]
TP2  TPB0,65  [TP_B0,65]
TP3  TPB0,65  [TP_B0,65]
TP4  TPB0,65  [TP_B0,65]
TP5  TESTPAD/W_HOLE_1X1  [TESTPAD/W_HOLE_1X1]
TP6  TESTPAD/W_HOLE_1X1  [TESTPAD/W_HOLE_1X1]
TP7  TESTPAD/W_HOLE_1X1  [TESTPAD/W_HOLE_1X1]
TP8  TESTPAD/W_HOLE_1X1  [TESTPAD/W_HOLE_1X1]
TP9  TPB0,65  [TP_B0,65]
TP10  TEST-POINT-D65/35  [TP-D65/35MIL]
TP11  TPB0,65  [TP_B0,65]
TP12  TPB0,65  [TP_B0,65]
TP13  TPB0,65  [TP_B0,65]
TP14  TPB0,65  [TP_B0,65]
TP15  TPB0,65  [TP_B0,65]
TP16  TPB0,65  [TP_B0,65]
TP17  TEST-POINT'4545'  [TP-D45MIL]
TP18  TEST-POINT'4545'  [TP-D45MIL]
TP19  TEST-POINT'4545'  [TP-D45MIL]
TP20  TEST-POINT'4545'  [TP-D45MIL]
TP21  TPB0,65  [TP_B0,65]
TP22  TPB0,65  [TP_B0,65]
TP23  TPB0,65  [TP_B0,65]
TP24  TPB0,65  [TP_B0,65]
TP25  TEST-POINT'4545'  [TP-D45MIL]
TP26  TESTPAD/W_HOLE_1X1  [TESTPAD/W_HOLE_1X1]
TP27  TEST-POINT'4545'  [TP-D45MIL]
TP28  TEST-POINT'4545'  [TP-D45MIL]
TP29  TEST-POINT'4545'  [TP-D45MIL]
TP30  TEST-POINT'4545'  [TP-D45MIL]
TP31  TEST-POINT'4545'  [TP-D45MIL]
TP32  TEST-POINT'4545'  [TP-D45MIL]
TP34  TEST-POINT-D65/35  [TP-D65/35MIL]
U1  OSD3358-512M-BSM  MPU-OSD3358-512M-BSM  [BGA256-1.27-21X21MM]
U2  SN74LVC1G07DCKR  LOGIC-SN74LVC1G07-DCK  [5P-SMD-2X1.2X1MM]
U3  ATL431AIDBZR  PMIC-CJ432'CJ432'  [SOT-23]
U4  WL1835MODGBMOCT  MODULE-RF-WL1835MOD  [MODULE100P-0.7-13.5X13.2MM]
U5  APX811-44UG-7  SUPERVISOR-APX811-31UGSOT  [SOT143-R]
U6  TPS54302  PMIC-TPS54302  [SOT-23-6]
U7  TPS2051BDGNR  SWITCH-TPS2051B  [MSOP8-0.65-3X3MM]
U8  TLV62569DBVT  PMIC-TLV62569'DBVT'  [SOT-23-5]
U9  SN74LVC1G125DCKR  LOGIC-SN74AUP1G125'DCK'  [SOT-353]
U10  SN74LVC2G241DCUR  LOGIC-SN74LVC2G241  [DCU8]
U11  IT66121FN  TRANSFER_IT66121FN-9  [QFN64-0.5-9X9MM]
U12  A4988SETTR-T  TRANSLATOR-A4983  [QFN-28-5MM]
U13  ESD-RCLAMP0524P  [ESD10P-0.5-2.5X1X0.58MM]
U14  ESD-RCLAMP0524P  [ESD10P-0.5-2.5X1X0.58MM]
U16  TLV62569DBVT  PMIC-TLV62569'DBVT'  [SOT-23-5]
VR1  EVM3GSX50B14  RES-ADJ-SMD  [ADJR3-SMD-3.6X3.3MM]
X1  ST3215SB32768H5HPWAA  CRYSTAL-2P-3215  [X2-SMD-3.2X1.5X0.55MM]
Y1  CX3225GB24000P0HPQCC  7A-24.000MAAJ-T  [CRYSTAL-TXC-7A]

## Nets
1.8V-WIFI: C2.1 C7.2 C8.1 L1.2 R4.1 R6.1 R7.1 R8.1 R9.1 R10.1 R30.1 U4.38(VIO)
3.3V-WIFI: C3.2 C4.1 C5.1 C6.1 L2.2 R5.2 R11.2 R12.2 U4.46(VBAT_IN1) U4.47(VBAT_IN2)
12VDC: C48.+ C51.+ C68.2 R97.2 U12.22(VBB1) U12.28(VBB2)
AGND: C25.2 C27.2 C28.2 R66.2 U1.A9(B:AGND_ADC)
AIN7: U1.D6(B:PMIC_MUX_OUT) U1.D7(B:AIN7)
B_UART0_RX: J4.4 R80.2 U10.2(1A)
B_UART0_TX: J4.5 U10.3(2Y)
BAT_SENSE: TP6.P$1(TP) U1.N7(A:PMIC_BAT_SENSE)
BT_EN: Q3.1(G) U1.H15(D:MII1_TXD0) U4.41(BT_EN)
BT_HCI_CTS: R14.2 U1.D13(D:MDC)
BT_HCI_RTS: R13.2 U1.E13(D:MDIO)
BT_HCI_RX: R16.2 U1.D15(D:MII1_RXD2)
BT_HCI_TX: R15.2 U1.D14(D:MII1_RXD3)
CEC: D12.1 J6.13(CE_REMOTE) R106.2 U11.17(CEC)
CGND: C11.2 J1.P1(GND) J1.P3(GND) J1.P4(GND) J1.P5(GND) J1.P6(GND) J3.G2 J3.G3 J3.G4(G3) J6.PAD1(SHELL2) J6.PAD2(SHELL3) J6.PAD3(SHELL4) J6.PAD(SHELL1) JP2.SG1(GND) JP2.SG2(GND) MGT1.P$1 MGT2.P$1 MGT3.P$1 MGT4.P$1 R48.2
CK_N: J6.12(CK-) U11.21(TXCM) U14.5 U14.6
CK_P: J6.10(CK+) U11.22(TXCP) U14.4 U14.7
CLKOUT2: C37.2 R79.2 R96.2 U4.36(EXT_32K)
COILA+: J5.1 U12.21(OUT1B)
COILA-: J5.2 U12.24(OUT1A)
COILB+: J5.4 U12.1(OUT2B)
COILB-: J5.3 U12.26(OUT2A)
CUR_REF: U12.17(REF) VR1.2
D0_N: J6.9(D0-) U11.24(TX0M) U14.2 U14.9
D0_P: J6.7(D0+) U11.25(TX0P) U14.1 U14.10
D1_N: J6.6(D1-) U11.26(TX1M) U13.5 U13.6
D1_P: J6.4(D1+) U11.27(TX1P) U13.4 U13.7
D2_N: J6.3(D2-) U11.29(TX2M) U13.2 U13.9
D2_P: J6.1(D2+) U11.30(TX2P) U13.1 U13.10
DDC_SCL: D9.1 J6.15(DDC_CLK) R102.2 R104.2
DDC_SDA: D10.1 J6.16(DDC_DATA) R103.2 R105.2
DIR(GPIO23): R88.1 U1.P5(C:GPMC_AD9) U12.19(DIR)
EEPROM_WP: TP10.P1(T) U1.M2(A:EEPROM_WP) U1.N3(C:GPMC_BEN0_CLE)
ENABLE(GPIO46): R94.1 U1.T6(C:GPMC_AD14) U12.2(ENABLE)
GND: ANT1.GND1 ANT1.GND2 ANT2.GND1 ANT2.GND2 C1.- C2.2 C3.1 C4.2 C5.2 C6.2 C7.1 C8.2 C11.1 C16.1 C17.1 C18.1 C20.2 C21.1 C22.1 C24.2 C26.1 C29.1 C30.1 C31.2 C32.2 C33.1 C34.2 C35.1 C36.1 C37.1 C38.1 C39.2 C40.1 C41.2 C42.2 C43.2 C44.1 C45.2 C46.2 C47.2 C48.- C49.2 C50.2 C51.- C52.2 C53.2 C54.2 C55.2 C57.2 C58.2 C59.2 C60.2 C61.1 C62.1 C63.1 C64.1 C65.1 C66.1 C67.2 C69.1 C70.1 C71.1 C72.1 C73.1 C74.1 C75.1 C76.1 C77.1 C78.1 C79.1 C80.1 C81.1 C82.1 C83.1 C84.1 D9.2 D10.2 D11.2 D12.2 D13.2 IC1.4(GND) IC2.4(GND) J1.5(GND) J2.- J2.CDN J3.6(VSS) J4.1 J6.2(D2_SHIELD) J6.5(D1_SHIELD) J6.8(D0_SHIELD) J6.11(CK_SHIELD) J6.17(GND) J7.1 J7.4 J8.1 J8.4 JP2.4(GND) Q1.2(S) Q2.2(S) Q3.2(S) R3.2 R18.2 R32.1 R33.1 R35.1 R36.1 R37.1 R38.1 R39.1 R40.1 R41.1 R42.1 R43.1 R46.1 R48.1 R49.1 R50.1 R51.2 R52.2 R53.2 R54.2 R58.1 R61.1 R62.2 R64.1 R70.1 R77.1 R79.1 R80.1 R94.2 R98.2 R99.1 R101.1 R107.1 R108.2 R109.1 R110.1 R111.1 R114.1 R119.2 SW1.1 SW1.2 SW2.1 SW2.2 TP8.P$1(TP) U1.D8(E:DGND) U1.D9(E:DGND) U1.E5(E:DGND) U1.E6(E:DGND) U1.E7(E:DGND) U1.E8(E:DGND) U1.E9(E:DGND) U1.E10(E:DGND) U1.E11(E:DGND) U1.E12(E:DGND) U1.F5(E:DGND) U1.F12(E:DGND) U1.G5(E:DGND) U1.G12(E:DGND) U1.H4(E:DGND) U1.H5(E:DGND) U1.H12(E:DGND) U1.H13(E:DGND) U1.J4(E:DGND) U1.J5(E:DGND) U1.J12(E:DGND) U1.J13(E:DGND) U1.K5(E:DGND) U1.K12(E:DGND) U1.L5(E:DGND) U1.L12(E:DGND) U1.M5(E:DGND) U1.M6(E:DGND) U1.M7(E:DGND) U1.M8(E:DGND) U1.M9(E:DGND) U1.M10(E:DGND) U1.M11(E:DGND) U1.M12(E:DGND) U1.N8(E:DGND) U1.N9(E:DGND) U2.3(GND) U4.1(GND1) U4.7(GND2) U4.9(GND3) U4.15(GND4) U4.16(GND5) U4.17(GND6) U4.19(GND7) U4.20(GND8) U4.23(GND9) U4.24(GND10) U4.28(GND11) U4.29(GND12) U4.30(GND13) U4.31(GND14) U4.33(GND15) U4.34(GND16) U4.35(GND17) U4.37(GND18) U4.39(GND19) U4.44(GND20) U4.45(GND21) U4.48(GND22) U4.49(GND23) U4.54(GND24) U4.55(GND25) U4.59(GND26) U4.61(GND27) U4.63(GND28) U4.64(GND29) U4.G1 U4.G2 U4.G3 U4.G4 U4.G5 U4.G6 U4.G7 U4.G8 U4.G9 U4.G10 U4.G11 U4.G12 U4.G13 U4.G14 U4.G15 U4.G16 U4.G17 U4.G18 U4.G19 U4.G20 U4.G21 U4.G22 U4.G23 U4.G24 U4.G25 U4.G26 U4.G27 U4.G28 U4.G29 U4.G30 U4.G31 U4.G32 U4.G33 U4.G34 U4.G35 U4.G36 U5.1(GND) U6.1(GND) U7.1(GND) U7.9(THERMAL) U8.2(GND) U9.1(!OE) U9.3(GND) U10.1(*1OE) U10.4(GND) U11.41(D18) U11.42(D17) U11.43(D16) U11.50(D9) U11.52(D8) U11.59(D2) U11.60(D1) U11.61(D0) U11.65(GND) U12.3(GND) U12.18(GND) U12.PAD(GND_PAD) U13.3 U13.8 U14.3 U14.8 U16.2(GND) VR1.1 ; supply symbol labelled GND_POWER
HDMI_1V2: C61.2 C62.2 C63.2 C64.2 C65.2 C66.2 C82.2 C83.2 L10.2 R113.2 TP18.T U11.8(IVDD12) U11.18(PVCC12) U11.23(AVCC12) U11.28(DVDD12) U11.35(IVDD12) U11.56(IVDD12)
HDMI_3V3: C69.2 C71.2 C73.2 C76.2 C77.2 C78.2 L8.2 R81.1 R82.1 R83.1 R84.1 R100.1 R106.1 R109.2 TP19.T U11.1(OVDD) U11.9(VCC33) U11.13(OVDD33) U11.19(PVCC33) U11.34(OVDD) U16.1(EN)
HDMI_5V: C84.2 D11.1 F1.2 J6.18(+5V) R104.1 R105.1 TP20.T
HDMI_AUDBCLK: U1.A1(C:MCASP0_ACLKX) U11.7(SCK/MCLK)
HDMI_AUDDOUT: R85.1 R86.1 U1.B1(C:MCASP0_AHCLKR)
HDMI_AUDWCLK: U1.A2(C:MCASP0_FSX) U11.6(WS)
HDMI_INT: R83.2 U1.T15(C:GPMC_A9) U11.10(INT)
HDMI_NRST: C38.2 R84.2 U11.33(SYSRSTN)
HPD: D13.1 J6.19(HPD) R107.2 U11.14(HPD)
I2C0_SCL: R1.1 U1.C10(A:I2C0_SCL) U1.D10(A:PMIC_SCL)
I2C0_SDA: R2.1 U1.C11(A:I2C0_SDA) U1.D11(A:PMIC_SDA)
I2C2_SCL: R82.2 U1.A10(C:UART1_RTSN) U11.12(PCSCL)
I2C2_SDA: R81.2 U1.B10(C:UART1_CTSN) U11.11(PCSDA)
LCD_DATA0: C60.1 R50.2 U1.G3(D:LCD_DATA0) U11.58(D3)
LCD_DATA1: C59.1 R49.2 U1.G2(D:LCD_DATA1) U11.57(D4)
LCD_DATA2: C58.1 R46.2 U1.G1(D:LCD_DATA2) U11.55(D5)
LCD_DATA3: C57.1 R45.1 U1.H3(D:LCD_DATA3) U11.54(D6)
LCD_DATA4: C55.1 R44.1 U1.H2(D:LCD_DATA4) U11.53(D7)
LCD_DATA5: C46.1 R43.2 U1.H1(D:LCD_DATA5) U11.49(D10)
LCD_DATA6: C45.1 R42.2 U1.J3(D:LCD_DATA6) U11.48(D11)
LCD_DATA7: C43.1 R41.2 U1.J2(D:LCD_DATA7) U11.47(D12)
LCD_DATA8: C42.1 R40.2 U1.J1(D:LCD_DATA8) U11.46(D13)
LCD_DATA9: C41.1 R39.2 U1.K3(D:LCD_DATA9) U11.45(D14)
LCD_DATA10: C39.1 R38.2 U1.K2(D:LCD_DATA10) U11.44(D15)
LCD_DATA11: C54.1 R37.2 U1.K1(D:LCD_DATA11) U11.40(D19)
LCD_DATA12: C52.1 R36.2 U1.L3(D:LCD_DATA12) U11.39(D20)
LCD_DATA13: C50.1 R35.2 U1.L2(D:LCD_DATA13) U11.38(D21)
LCD_DATA14: C49.1 R34.1 U1.L1(D:LCD_DATA14) U11.37(D22)
LCD_DATA15: C47.1 R33.2 U1.M3(D:LCD_DATA15) U11.36(D23)
LCD_DE: R118.2 U11.62(DE)
LCD_HSYNC: R117.2 U11.63(HSYNC)
LCD_PCLK: R115.2 U11.51(PCLK)
LCD_VSYNC: R116.2 U11.64(VSYNC)
LDO_PGOOD: TP22.TP U1.N4(A:PMIC_LDO_PGOOD) U1.N5(A:RTC_PWRONRSTN)
MMC0_CD: J3.9(CDN) R75.1 U1.C14(C:SPI0_CS1)
MMC0_CLK: C40.2 J3.5(SCLK) R71.1 R95.1
MMC0_CMD: J3.3(DI) R68.1 U1.B16(C:MMC0_CMD)
MMC0_DAT0: J3.7(DO) R72.1 U1.A16(C:MMC0_DAT0)
MMC0_DAT1: J3.8(DATA1) R73.1 U1.A15(C:MMC0_DAT1)
MMC0_DAT2: J3.1(DATA2) R67.1 U1.C16(C:MMC0_DAT2)
MMC0_DAT3: J3.2(CS) R74.1 U1.C15(C:MMC0_DAT3)
MS1(GPIO27): R89.1 U1.T5(C:GPMC_AD11) U12.9(MS1)
MS2(GPIO44): R90.1 U1.P6(C:GPMC_AD12) U12.10(MS2)
MS3(GPIO45): R91.1 U1.R6(C:GPMC_AD13) U12.11(MS3)
MVCC: C53.1 L7.2 R87.2 R88.2 R89.2 R90.2 R91.2 R92.2 R93.2 R112.1 U12.15(VDD) ; supply symbol labelled VCC
N$1: J1.1(VCC) R47.1
N$2: D5.- R51.1
N$5: R31.2 U5.2(RESET#)
N$6: TP9.TP U1.F4(F:VDDS_DDR)
N$7: C81.2 F1.1 L9.2
N$8: D4.- R18.1
N$9: R20.2 R21.1 U3.1(R)
N$10: Q4.1(B) R17.1 U3.2(K)
N$11: D6.- R52.1
N$13: D7.- R53.1
N$15: D8.- R54.1
N$16: ANT2.D C10.1
N$17: ANT1.D C9.1
N$18: TP2.TP U1.G4(F:VDD_CORE)
N$19: TP3.TP U1.F13(F:VDD_MPU)
N$20: R96.1 U1.B4(C:XDMA_EVENT_INTR1)
N$21: TP4.TP U1.G13(F:VDDS_PLL)
N$22: R95.2 U1.B15(C:MMC0_CLK)
N$23: C9.2 U4.32(RF_ANT1)
N$24: C10.2 U4.18(RF_ANT2)
N$25: TP29.T U4.26(GPIO2)
N$27: R23.1 SW2.3 SW2.4
N$28: TP31.T U4.42(WL_UART_DBG)
N$29: TP32.T U4.43(BT_UART_DBG)
N$30: R24.1 U2.4(Y)
N$31: TP17.T U4.56(BT_AUD_IN)
N$32: R119.1 TP25.T U4.57(BT_AUD_OUT)
N$33: R3.1 U1.M16(A:RTC_KALDO_ENN)
N$34: TP28.T U4.60(BT_AUD_CLK)
N$35: TP30.T U4.27(GPIO1)
N$36: D2.- Q2.3(D)
N$37: R100.2 R101.2 U11.32(PCADR)
N$38: R98.1 U11.31(ENTEST)
N$39: R102.1 U11.16(DDCSCL)
N$40: R103.1 U11.15(DDCSDA)
N$41: R86.2 U11.2(I2S3/SPDIF)
N$42: R85.2 U11.5(I2S0)
N$43: TP27.T U4.58(BT_AUD_FSYNC)
N$44: R99.2 U11.20(REXT)
N$45: R19.1 U4.6(WL_SDIO_CMD)
N$46: D1.+ R5.1
N$47: D1.- Q1.3(D)
N$48: R111.2 U12.27(SENSE2)
N$49: R110.2 U12.23(SENSE1)
N$50: C56.1 U12.4(CP1)
N$51: C56.2 U12.5(CP2)
N$52: R108.1 U12.13(ROSC)
N$54: C67.1 U12.8(VREG)
N$55: C68.1 U12.6(VCP)
N$56: D3.- Q3.3(D)
N$57: D2.+ R11.1
N$59: D3.+ R12.1
N$60: R112.2 VR1.3
N$61: J7.2 U9.4(Y)
N$62: R29.1 R30.2 U4.14(WLAN_IRQ)
N$63: R28.1 U4.13(WL_SDIO_D3)
N$64: R27.1 U4.12(WL_SDIO_D2)
N$65: R26.1 U4.11(WL_SDIO_D1)
N$67: R25.1 U4.10(WL_SDIO_D0)
N$69: R22.1 U4.8(WL_SDIO_CLK)
N$70: R115.1 U1.F1(D:LCD_PCLK)
N$72: R116.1 U1.F3(D:LCD_VSYNC)
N$75: L10.1 U16.3(SW)
N$76: R113.1 R114.2 U16.5(FB)
N$77: R76.2 R78.2 U8.5(FB)
N$79: L6.1 U8.3(SW)
N$80: R76.1 R77.2
N$83: R117.1 U1.F2(D:LCD_HSYNC)
N$84: R57.1 R58.2 U6.5(EN)
N$85: R118.1 U1.E1(D:LCD_AC_BIAS_EN)
N$86: C19.2 U6.6(BOOT)
N$87: C19.1 L3.1 U6.2(SW)
N$88: C23.1 R59.1 R60.2
N$89: C23.2 R60.1 R61.2 U6.4(FB)
N$93: R13.1 U4.50(BT_HCI_RTS)
N$94: R14.1 U4.51(BT_HCI_CTS)
N$95: R15.1 U4.52(BT_HCI_TX)
N$96: R16.1 U4.53(BT_HCI_RX)
OSC0_GND: C12.2 C13.2 U1.N15(B:OSC0_GND)
OSC0_IN: C12.1 R55.2 U1.P16(B:OSC0_IN) Y1.P$2
OSC0_OUT: C13.1 R55.1 U1.N16(B:OSC0_OUT) Y1.P$1
OSC1_GND: C14.2 C15.2 U1.B5(B:OSC1_GND)
OSC1_IN: C14.1 R56.2 U1.A6(B:OSC1_IN) X1.2
OSC1_OUT: C15.1 R56.1 U1.A5(B:OSC1_OUT) X1.1
PMIC_INT: TP24.TP U1.D4(A:EXTINTN) U1.E4(A:PMIC_NINT)
PMIC_MUX_IN: R69.1 R70.2 U1.N13(B:PMIC_MUX_IN)
PMIC_NRESET: TP34.P1(T) U1.M13(A:PMIC_NRESET)
PMIC_NWAKEUP: TP23.TP U1.L4(A:PMIC_NWAKEUP) U1.M4(A:EXT_WAKEUP)
PMIC_PGOOD: U1.N12(A:PMIC_PGOOD) U1.P11(A:PWRONRSTN) U2.2(A)
PWR_BUT: SW1.3 SW1.4 U1.T11(A:PMIC_PB_IN)
PWR_EN: TP21.TP U1.N10(A:PMIC_POWER_EN) U1.N11(A:PMIC_PWR_EN)
PWR_IN_12V: C16.2 C17.2 C18.2 J2.+ R57.2 R97.1 TP1.T U6.3(VIN)
RESET: R23.2 R24.2 U5.3(MR#)
RESET(GPIO26): R93.1 U1.R5(C:GPMC_AD10) U12.12(RESET)
SLEEP(GPIO47): R92.1 U1.P7(C:GPMC_AD15) U12.14(SLEEP)
STEP(GPIO22): R87.1 U1.T4(C:GPMC_AD8) U12.16(STEP)
SYS_5V: C24.1 U7.2(IN1) U7.3(IN2)
SYS_ADC_1P8V: C28.1 R65.2 U1.A7(B:SYS_ADC_1P8V)
SYS_RESETN: R31.1 R32.2 TP26.P$1(TP) U1.R11(A:WARMRSTN)
SYS_RTC_1P8V: Q4.3(C) R20.1 TP14.TP U1.K11(A:SYS_RTC_1P8V) U1.L11(A:SYS_RTC_1P8V) U2.5(VCC) U3.3(A)
SYS_VDD1_3P3V: C32.1 C34.1 C44.2 C70.2 C72.2 J3.4(VDD) L8.1 R1.2 R2.2 R34.2 R44.2 R45.2 R63.1 R67.2 R68.2 R69.2 R71.2 R72.2 R73.2 R74.2 R75.2 TP12.TP U1.F6(A:SYS_VDD1_3P3V) U1.F7(A:SYS_VDD1_3P3V) U1.G6(A:SYS_VDD1_3P3V) U1.G7(A:SYS_VDD1_3P3V) U5.4(VCC) U8.1(EN) U10.7(2OE) U10.8(VCC)
SYS_VDD2_3P3V: D4.+ TP13.TP U1.F11(A:SYS_VDD2_3P3V) U1.G11(A:SYS_VDD2_3P3V)
SYS_VDD3_3P3V: Q4.2(E) R17.2 R21.2 TP16.TP U1.F8(A:SYS_VDD3_3P3V) U1.F9(A:VDDSHV4) U1.G8(A:SYS_VDD3_3P3V) U1.H7(A:SYS_VDD3_3P3V) U1.H8(A:SYS_VDD3_3P3V) U1.H9(A:VDDSHV6) U1.J7(A:SYS_VDD3_3P3V) U1.J8(A:SYS_VDD3_3P3V) U1.J9(A:VDDSHV1) U1.K8(A:SYS_VDD3_3P3V) U1.K9(A:VDDSHV2) U1.L8(A:SYS_VDD3_3P3V) U1.L9(A:VDDSHV3)
SYS_VDD_1P8V: L1.1 TP15.TP U1.F10(A:SYS_VDD_1P8V) U1.G9(A:VDDSHV5) U1.G10(A:SYS_VDD_1P8V) U1.H10(A:SYS_VDD_1P8V) U1.H11(A:SYS_VDD_1P8V) U1.J10(A:SYS_VDD_1P8V) U1.J11(A:SYS_VDD_1P8V) U1.K10(A:SYS_VDD_1P8V) U1.L10(A:SYS_VDD_1P8V)
SYS_VOUT: C74.2 C75.2 C79.2 C80.2 L9.1 TP11.TP U1.K6(A:SYS_VOUT) U1.K7(A:SYS_VOUT) U1.L6(A:SYS_VOUT) U1.L7(A:SYS_VOUT) U16.4(VIN)
TEMP_SENSE: TP7.P$1(TP) U1.N6(A:PMIC_TS)
TO_NEOPIXEL: U1.B2(C:MCASP0_AXR0) U9.2(A)
UART0_RX: U1.A12(C:UART0_RXD) U10.6(1Y)
UART0_TX: U1.B12(C:UART0_TXD) U10.5(2A)
USB0_DM: IC1.1(D+) J1.2(DM) U1.K16(B:USB0_DM)
USB0_DP: IC1.2(D-) J1.3(DP) U1.K15(B:USB0_DP)
USB0_ID: IC1.3(ID) J1.4(ID) U1.K14(B:USB0_ID)
USB1_DM: IC2.1(D+) JP2.2(D-) U1.L16(B:USB1_DM)
USB1_DP: IC2.2(D-) JP2.3(D+) U1.L15(B:USB1_DP)
USB1_DRVVBUS: R62.1 U1.M14(B:USB1_DRVVBUS) U7.4(EN#)
USB1_ID: R64.2 U1.L14(B:USB1_ID)
USB1_OC#: R63.2 U7.5(OC#)
USB1_VBUS: L4.2 U1.M15(B:USB1_VBUS)
USR0: D5.+ U1.P13(C:GPMC_A5)
USR1: D6.+ U1.T14(C:GPMC_A6)
USR2: D7.+ U1.R14(C:GPMC_A7)
USR3: D8.+ U1.P14(C:GPMC_A8)
VBUS.HOST: JP2.1(VBUS) L5.2
VBUS.OUT: C31.1 IC2.6(VBUS) L4.1 L5.1 U7.6(OUT1) U7.7(OUT2) U7.8(OUT3)
VDD_3V3B: C35.2 C36.2 L2.1 L6.2 L7.1 R78.1
VDD_5V: C1.+ C21.2 C22.2 C26.2 C29.2 C30.2 C33.2 J7.3 J8.2 J8.3 L3.2 R59.2 U1.P10(A:VIN_AC) U1.R10(A:VIN_AC) U1.T10(A:VIN_AC) U8.4(VIN) U9.5(VCC)
VDD_BAT: TP5.P$1(TP) U1.P8(A:VIN_BAT) U1.R8(A:VIN_BAT) U1.T8(A:VIN_BAT)
VDD_USB_5V: C20.1 IC1.6(VBUS) R47.2 U1.J16(B:USB0_VBUS) U1.P9(A:VIN_USB) U1.R9(A:VIN_USB) U1.T9(A:VIN_USB)
VREFN: R66.1 U1.B9(B:VREFN)
VREFP: C25.1 C27.1 R65.1 U1.B7(B:VREFP)
WIFI_LED(GPIO3_01): Q1.1(G) U1.F14(D:MII1_CRS)
WL_EN: Q2.1(G) U1.H16(D:MII1_TX_CLK) U4.40(WLAN_EN)
WL_IRQ: R29.2 U1.H14(D:MII1_TXD1)
WL_SDIO_CLK: R9.2 R22.2 U1.D16(D:MII1_RXD1)
WL_SDIO_CMD: R10.2 R19.2 U1.G14(D:MII1_TX_EN)
WL_SDIO_D0: R4.2 R25.2 U1.F16(D:MII1_RX_DV)
WL_SDIO_D1: R6.2 R26.2 U1.G15(D:MII1_TXD3)
WL_SDIO_D2: R7.2 R27.2 U1.G16(D:MII1_TXD2)
WL_SDIO_D3: R8.2 R28.2 U1.F15(D:MII1_COL)
Unconnected: FUD1.P$1 FUD2.P$1 FUD3.P$1 FUD4.P$1 FUD5.P$1 FUD6.P$1 IC1.5(NC) IC2.3(ID) IC2.5(NC) J3.G1 J4.2 J4.3 J4.6 J6.14(NC) U1.A3(C:MCASP0_ACLKR) U1.A4(C:XDMA_EVENT_INTR0) U1.A8(B:AIN0) U1.A11(C:UART1_RXD) U1.A13(C:SPI0_SCLK) U1.A14(C:SPI0_CS0) U1.B3(C:MCASP0_FSR) U1.B6(B:AIN2) U1.B8(B:AIN1) U1.B11(C:UART1_TXD) U1.B13(C:SPI0_D0) U1.B14(C:SPI0_D1) U1.C1(B:TDI) U1.C2(B:TDO) U1.C3(C:MCASP0_AXR1) U1.C4(C:MCASP0_AHCLKX) U1.C5(C:ECAP0_IN_PWM0_OUT) U1.C6(B:AIN3) U1.C7(B:AIN4) U1.C8(B:AIN5) U1.C9(B:AIN6) U1.C12(C:UART0_CTSN) U1.C13(C:UART0_RTSN) U1.D1(B:TCK) U1.D2(B:TMS) U1.D3(B:TRSTN) U1.D5(F:CAP_VDD_RTC) U1.D12(F:NC) U1.E2(B:EMU0) U1.E3(B:EMU1) U1.E14(D:MII1_RXD0) U1.E15(D:MII1_RX_ER) U1.E16(D:MII1_RX_CLK) U1.H6(F:VPP) U1.J6(F:NC) U1.J14(D:RMII1_REF_CLK) U1.J15(B:USB0_DRVVBUS) U1.K4(F:NC) U1.K13(B:USB0_CE) U1.L13(B:USB1_CE) U1.M1(C:GPMC_ADVN_ALE) U1.N1(C:GPMC_OEN_REN) U1.N2(C:GPMC_WEN) U1.N14(C:GPMC_BEN1) U1.P1(C:GPMC_CSN2) U1.P2(C:GPMC_CSN1) U1.P3(C:GPMC_CSN0) U1.P4(C:GPMC_AD6) U1.P12(C:GPMC_A2) U1.P15(C:GPMC_WAIT0) U1.R1(C:GPMC_AD2) U1.R2(C:GPMC_AD1) U1.R3(C:GPMC_AD0) U1.R4(C:GPMC_AD7) U1.R7(C:GPMC_CSN3) U1.R12(C:GPMC_A1) U1.R13(C:GPMC_A4) U1.R15(C:GPMC_A10) U1.R16(C:GPMC_WPN) U1.T1(C:GPMC_AD5) U1.T2(C:GPMC_AD4) U1.T3(C:GPMC_AD3) U1.T7(C:GPMC_CLK) U1.T12(C:GPMC_A0) U1.T13(C:GPMC_A3) U1.T16(C:GPMC_A11) U2.1(NC) U4.2(GPIO11) U4.3(GPIO9) U4.4(GPIO10) U4.5(GPIO12) U4.21(RESERVED1) U4.22(RESERVED2) U4.25(GPIO4) U4.62(RESERVED3) U11.3(I2S2) U11.4(I2S1) U12.7(NC) U12.20(NC) U12.25(NC)

## Notes on the sheet
- www.schmalzhaus.com/BigEasyDriver
- I = 100mA | I = 1A
- WiFi Module
- FAN Connector
- Current adj pot
- I = 200mA
- Motor current 0mA to over 2A/phase
- BigEasyDriver v1.2 by Brian Schmalz is
- licensed under a Creative Commons
- Attribution 3.0 US License
- Neopixel Connector
- I = 1A
- I = 3A
- I = 200mA
- I = 2A
- short route
- I = 2A
- I = 2A
- I = 2A
- Vout=0.6Vx(1+R1/R2)
- 12/12
- HDMI
- SiP GND & Misc
- Boot configuration
- Micro SD card slot
- Differential impedance: 100 Ohm
- Red
- SYSBOOT[15:0] functionality can be found
  in the "SYSBOOT Configuration Pins" section
  of the AM335x TRM (spruh73)
- I = 500mA
- SYSBOOT[15:0] = 0x4018 (SD boot)
    - Boot Order: SPI0, MMC0, USB0, UART0
- Green
- Configuration:
    - 24 MHz Crystal (SYSBOOT[14:15] = 01b)
    - CLKOUT1 disabled (SYSBOOT[5] = 0b)
- Blue
- I = 100mA
- I = 200mA
- ESD Protection Diodes 
   close to HDMI Connector.
- PCADR pull high: 0x9A
  PCADR pull low : 0x98
- I = 100mA
- I = 100mA
- I = 200mA
- I = 200mA
- Mounting Holes | Fiducials
- User LEDs
- Mounting holes and other connector shields are part
  of a ground ring, CGND.  This ring is connected to 
  ground via a resistor on Page 1.
- 4/12 | 5/12 | 9/12
- These signals are all 1.8V
- Power & Reset
- Clocks, Analog & USB | SiP Interfaces
- The values for C7 and C12 can be calculated using
  information in FAQ: https://octavosystems.com/faqs/design-oscillator-circuit-osd335x-family-devices/#more-3862
- I = 2A
- Clock resistors R32 and R24 may not be needed in your design.
  See https://octavosystems.com/osd335x/clock/ for more information.
- I = 100mA
- UART0 debug header
- If the analog interface is not used, 
  then VREFP and VREFN should be 
  shorted to AGND.
- I = 1A
- I = 1A
- Power input protection.  Adjust 
  according to your application.
- SYS_ADC_1P8V and AGND_ADC are connected
  to SYS_VDD_1P8V and DGND, respectively, 
  through ferrite beads inside the SiP.  It is 
  not necessary to connect these rails to 
  anything else.  However, bypass capacitors 
  should be added to reduce noise, if needed 
  for your application.
- Battery Connector
- Maximum voltage for the analog 
  inputs is 1.8V.
- 32kHz Oscillator is used for 
  RTC.  If your application 
  does not use the RTC, then 
  this can be removed.
- This is a clamping circuit between the SYS_RTC_1P8V 
  and SYS_VDD3_3P3V outputs of the TPS65217
  power management IC inside the OSD335x-SM.  The
  clamping circuit is related to power down issues 
  (see https://octavosystems.com/osd335x/clamping/ 
  for more information). This may not be needed in 
  your application if the power down conditions do 
  not apply to your application.
- AIN7 currently monitors the PMIC voltages 
  via the internal PMIC mux.  See the `Analog 
  Multiplexer' section of the TPS65217 
  datasheet.  For the internal PMIC voltages, 
  there are dividers within the PMIC to keep 
  the montiored voltages under 1.8V.  However, 
  PMIC_MUX_IN does not have any dividers 
  and must be less than 1.8V.  By default, 
  PMIC_MUX_OUT is Hi-Z.  The MUXCTRL 
  register in the PMIC is used to select the 
  PMIC_MUX_OUT voltage path.
- The 0 Ohm resistor (R10) on the 
  VBUS input can be replaced with 
  a ferrite bead for noise 
  suppresion or a solder bridge 
  for cost reduction.
- Reset supervisor circuit
- I = 100mA
- USB Client
- SYS_VDD1_3P3V is a 3.3V output of the 
  OSD3358-512M-BSM.  A divide by 2 resistor 
  divider is used to ensure that the PMIC_MUX_IN 
  voltage does not exceed 1.8V.  It is not 
  necessary to monitor the TL5209 LDO output 
  and this can be removed if desired.
- I = 500mA
- Resistor and capacitor footprints 
  are added to CLKOUT1/CLKOUT2 in 
  case EMI suppression is needed.
- RTC_KALDO_ENN is grounded thru a 10K ohm resistor so that 
  the internal RTC LDO is enabled and CAP_VDD_RTC does not 
  need to be connected to VDD_CORE.
- Reset inputs:
      1) Manual push-button
      2) PMIC_PGOOD
  Reset supervisor MR# has internal pull up to SYS_VDD1_3P3V.  Each 
  reset input is effectively open drain and can only pull reset line 
  low. Resistors added only for debug and are not necessary.
- To Print:  Use 8.5"x11" paper in landscape; 0.69 scaling factor.
- 1/12 | 2/12 | 3/12
- USB Host

## Library data of the parts
ANT1 ANT2 = Connector-new:ANTENNA-U-FL: 320110048
C1 C48 C51 = Discrete-new:CAP-POLAR: Electrolytic Capacitors,Tantalum Capacitors and Super Capacitors
C2-C47 C49 C50 C52-C84 = Discrete-new:CAP: Ceramic Capacitors
D1-D8 = Discrete-new:LED
D9-D13 = Discrete-new:D-ESD-2P: SOD-923:304060009;SOD-123:304060001
F1 = Discrete-new:FUSE
FUD1-FUD6 = OSD3358-SM-RED Platform:FIDUCIAL
IC1 IC2 = IC-new:TVS-TPD4S012DRYR
J1 = Connector-new:MICRO-USB5+4P: 320010137:MICRO USB B型DIP 沉板0.7无卷边 -ST-USB-01H2 320010000:MICRO USB 5F CCHT 6.45(0.8X0.9) -ST-USB-001G 320010050:USB-MC-001-05 320010025:MICRO USB 5S AB TYPE DIP7.2
J2 = Connector-new:POWER-JACK-DC: 3P-L11.6*W9.6*H7.0MM:320120002;3P-L14.2*W11.0*H9.0MM:320120003
J3 = Connector-new:MICRO-SD-CARD-HOLDER-9P: 320090000; SKU: 320090000
J4 = OSD3358-SM-RED Platform:826646-6: 6-pin 100 mil header; MPN: P125-1106A1BS116A1; VALUE: 6p-2.54
J5 J7 J8 = Connector-new:HEADER-4P
J6 = template:CONNECTOR-HDMI-19P
JP2 = Connector-new:USB4+2P
L1-L5 L7-L9 = Discrete-new:INDUCTOR/FERRITE-BEAD
L6 L10 = Discrete-new:L
MGT1-MGT4 = OSD3358-SM-RED Platform:MOUNTING_HOLE: Chassis Mounting Hole w/GND connection ability
Q1-Q3 = Discrete-new:MOSFET-N
Q4 = Discrete-new:TRANSISTOR-PNP: PNP audion
R1-R119 = Discrete-new:RES
SW1 SW2 = Discrete-new:BUTTON-4P+
TP1 = discrete:PAD-TEST-POINT; PARTNO: DNP
TP2-TP4 TP9 TP11-TP16 TP21-TP24 = OSD3358-SM-RED Platform:TP: Test pad
TP5-TP8 TP26 = OSD3358-SM-RED Platform:TESTPAD/W_HOLE_1X1: Test point (Through hole)
TP10 TP34 = Discrete-new:TEST-POINT
TP17-TP20 TP25 TP27-TP32 = Discrete-new:TEST-POINT; PARTNO: DNP
U1 = IC-new:MPU-OSD3358-512M-BSM: 310010936
U2 = IC-new:LOGIC-SN74LVC1G07: DRL:310050096 DCK:310050079
U3 = IC-new:PMIC-CJ432: 310030079
U4 = moudle-new:MODULE-RF-WL1835MOD
U5 = IC-new:SUPERVISOR-APX811-31UG
U6 = IC-new:PMIC-TPS54302
U7 = IC-new:SWITCH-TPS2051B
U8 U16 = IC-new:PMIC-TLV62569
U9 = IC-new:LOGIC-SN74AUP1G125: LOW-POWER SINGLE BUS BUFFER GATE WITH 3-STATE OUTPUT
U10 = IC-new:LOGIC-SN74LVC2G241
U11 = IC-new:TRANSFER_IT66121FN
U12 = IC-new:TRANSLATOR-A4983
U13 U14 = Discrete-new:ESD-RCLAMP0524P
VR1 = Discrete-new:RES-ADJ: Potentiometer
X1 = Discrete-new:CRYSTAL-2P
Y1 = OSD3358-SM-RED Platform:7A-24.000MAAJ-T

## Net classes
0 default: width 0.102 mm, drill 0.254 mm
1 ground: width 0.102 mm, drill 0.254 mm, clearance 0.152 mm